# EAGLE design apollo3 MCU (EAGLE 9.6.2)

## Sheet 1 of 2
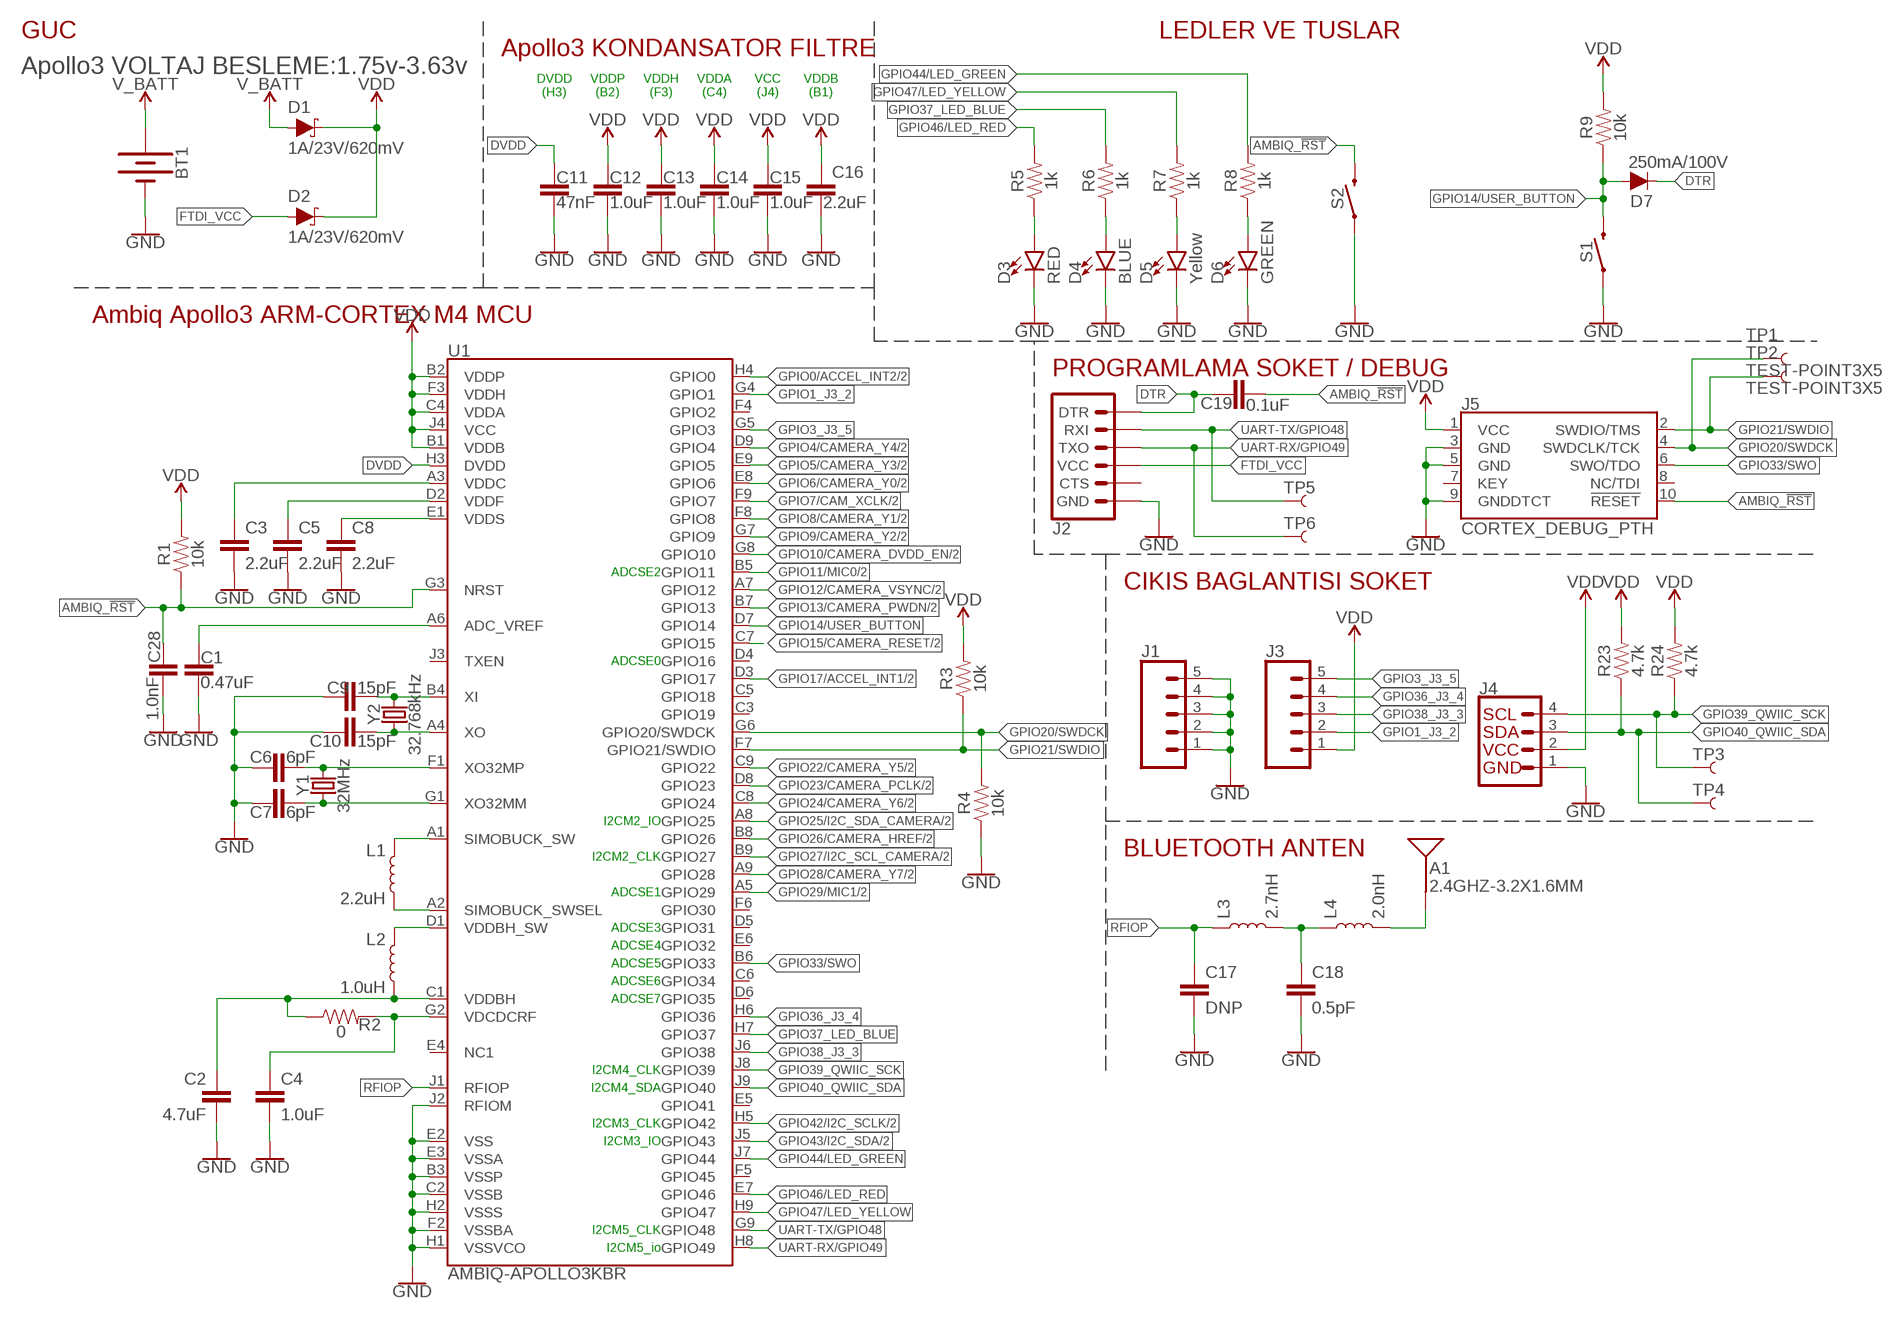
[diagram p0: schematic, sheet 1]

### Parts
A1  2.4GHZ-3.2X1.6MM  ANTENNA-2.4GHZ-3.2X1.6MM  [ANT-2.4GHZ-3.2X1.6X1.2MM]
BT1  BATTERY-20MM_SMD_4LEGS_OVERPASTE_INNER  [BATTCON_20MM_4LEGS_OVERPASTE_INNER]
C1  0.47uF  0.47UF-0402-TIGHT-6.3V-10%  [0402-TIGHT]
C2  4.7uF  4.7UF-0402-TIGHT-6.3V-(20%)  [0402-TIGHT]
C3  2.2uF  2.2UF-0402-TIGHT-25V-10%  [0402-TIGHT]
C4  1.0uF  1.0UF-0402-TIGHT-16V-10%  [0402-TIGHT]
C5  2.2uF  2.2UF-0402-TIGHT-25V-10%  [0402-TIGHT]
C6  6pF  6PF-0402-TIGHT-50V-0.5%  [0402-TIGHT]
C7  6pF  6PF-0402-TIGHT-50V-0.5%  [0402-TIGHT]
C8  2.2uF  2.2UF-0402-TIGHT-25V-10%  [0402-TIGHT]
C9  15pF  15PF-0402-TIGHT-50V-5%  [0402-TIGHT]
C10  15pF  15PF-0402-TIGHT-50V-5%  [0402-TIGHT]
C11  47nF  47NF-0402-TIGHT-25V-10%  [0402-TIGHT]
C12  1.0uF  1.0UF-0402-TIGHT-16V-10%  [0402-TIGHT]
C13  1.0uF  1.0UF-0402-TIGHT-16V-10%  [0402-TIGHT]
C14  1.0uF  1.0UF-0402-TIGHT-16V-10%  [0402-TIGHT]
C15  1.0uF  1.0UF-0402-TIGHT-16V-10%  [0402-TIGHT]
C16  2.2uF  2.2UF-0402-TIGHT-25V-10%  [0402-TIGHT]
C17  DNP  DNP-CAP-0402-TIGHT  [0402-TIGHT]
C18  0.5pF  0.5PF-0402-0.5PF-1%  [0402-TIGHT]
C19  0.1uF  0.1UF-0402-TIGHT-16V-10%  [0402-TIGHT]
C28  1.0nF  1.0NF/1000PF-0402-50V-10%  [0402-TIGHT]
D1  1A/23V/620mV  DIODE-SCHOTTKY-BAT20J  [SOD-323@1]
D2  1A/23V/620mV  DIODE-SCHOTTKY-BAT20J  [SOD-323@1]
D3  RED  LED-RED0603  [LED-0603]
D4  BLUE  LED-BLUE0603  [LED-0603]
D5  Yellow  LED-YELLOW0603  [LED-0603]
D6  GREEN  LED-GREEN0603  [LED-0603]
D7  250mA/100V  DIODE-BAS16J  [SOD-323]
J1  CONN_05NO_SILK  [1X05_NO_SILK]
J2  6_PIN_SERIAL_TARGETSMD  [1X06-SMD_RA_MALE]
J3  CONN_05NO_SILK  [1X05_NO_SILK]
J4  QWIIC_CONNECTORJS-1MM  [1X04_1MM_RA]
J5  CORTEX_DEBUG_PTH  [2X5-PTH-1.27MM]
L1  2.2uH  INDUCTOR-0805-2.2UH  [0805-WIDE]
L2  1.0uH  INDUCTOR-0805-1.0UH  [0805-WIDE]
L3  2.7nH  INDUCTOR-0402-2.7NH  [0402-TIGHT]
L4  2.0nH  INDUCTOR-0402-2.0NH  [0402-TIGHT]
R1  10k  10KOHM-0402-TIGHT-1/10W-1%  [0402-TIGHT]
R2  0  0OHM-0402-TIGHT-1/10W-5%  [0402-TIGHT]
R3  10k  10KOHM-0402-TIGHT-1/10W-1%  [0402-TIGHT]
R4  10k  10KOHM-0402-TIGHT-1/10W-1%  [0402-TIGHT]
R5  1k  1KOHM-0603-1/10W-1%  [0603]
R6  1k  1KOHM-0603-1/10W-1%  [0603]
R7  1k  1KOHM-0603-1/10W-1%  [0603]
R8  1k  1KOHM-0603-1/10W-1%  [0603]
R9  10k  10KOHM-0402-TIGHT-1/10W-1%  [0402-TIGHT]
R23  4.7k  4.7KOHM-0603-1/10W-1%  [0603]
R24  4.7k  4.7KOHM-0603-1/10W-1%  [0603]
S1  MOMENTARY-SWITCH-SPST-SMD-5.2-TALL-REDUNDANT  [TACTILE_SWITCH_SMD_5.2MM]
S2  MOMENTARY-SWITCH-SPST-SMD-5.2-TALL-REDUNDANT  [TACTILE_SWITCH_SMD_5.2MM]
TP1  TEST-POINT3X5  [PAD.03X.05]
TP2  TEST-POINT3X5  [PAD.03X.05]
TP3  TEST-POINT3X5  [PAD.03X.05]
TP4  TEST-POINT3X5  [PAD.03X.05]
TP5  TEST-POINT3X5  [PAD.03X.05]
TP6  TEST-POINT3X5  [PAD.03X.05]
U1  AMBIQ-APOLLO3KBR  [BGA-81-5X5MM]
Y1  32MHz  CRYSTAL-32MHZ-SMD-2.0X1.6MM  [CRYSTAL-SMD-2.0X1.6MM]
Y2  32.768kHz  CRYSTAL-32.768KHZSMD-3.2X1.5  [CRYSTAL-SMD-3.2X1.5MM]

### Nets
ADC_VREF: C1.1 U1.A6(ADC_VREF)
AMBIQ_!RST: C19.2 C28.1 J5.10(!RESET) R1.1 S2.3 S2.4 U1.G3(NRST)
DTR: C19.1 D7.C J2.1(DTR)
DVDD: C11.1 U1.H3(DVDD)
FTDI_VCC: D2.A J2.4(VCC)
GND: BT1.2(-) C1.2 C2.2 C3.2 C4.2 C5.2 C6.1 C7.1 C8.2 C9.1 C10.1 C11.2 C12.2 C13.2 C14.2 C15.2 C16.2 C17.2 C18.2 C28.2 D3.C D4.C D5.C D6.C J1.1 J1.2 J1.3 J1.4 J1.5 J2.6(GND) J4.1 J5.3(GND) J5.5(GND) J5.9(GNDDTCT) R4.1 S1.1 S1.2 S2.1 S2.2 U1.B3(VSSP) U1.C2(VSSB) U1.E2(VSS) U1.E3(VSSA) U1.F2(VSSBA) U1.H1(VSSVCO) U1.H2(VSSS) U1.J2(RFIOM) ; also sheet 2
GPIO0/ACCEL_INT2: U1.H4(GPIO0) ; also sheet 2
GPIO1_J3_2: J3.2 U1.G4(GPIO1)
GPIO3_J3_5: J3.5 U1.G5(GPIO3)
GPIO4/CAMERA_Y4: U1.D9(GPIO4) ; also sheet 2
GPIO5/CAMERA_Y3: U1.E9(GPIO5) ; also sheet 2
GPIO6/CAMERA_Y0: U1.E8(GPIO6) ; also sheet 2
GPIO7/CAM_XCLK: U1.F9(GPIO7) ; also sheet 2
GPIO8/CAMERA_Y1: U1.F8(GPIO8) ; also sheet 2
GPIO9/CAMERA_Y2: U1.G7(GPIO9) ; also sheet 2
GPIO10/CAMERA_DVDD_EN: U1.G8(GPIO10) ; also sheet 2
GPIO11/MIC0: U1.B5(GPIO11) ; also sheet 2
GPIO12/CAMERA_VSYNC: U1.A7(GPIO12) ; also sheet 2
GPIO13/CAMERA_PWDN: U1.B7(GPIO13) ; also sheet 2
GPIO14/USER_BUTTON: D7.A R9.1 S1.3 S1.4 U1.D7(GPIO14)
GPIO15/CAMERA_RESET: U1.C7(GPIO15) ; also sheet 2
GPIO17/ACCEL_INT1: U1.D3(GPIO17) ; also sheet 2
GPIO20/SWDCK: J5.4(SWDCLK/TCK) R4.2 TP1.P$1 U1.G6(GPIO20/SWDCK)
GPIO21/SWDIO: J5.2(SWDIO/TMS) R3.1 TP2.P$1 U1.F7(GPIO21/SWDIO)
GPIO22/CAMERA_Y5: U1.C9(GPIO22) ; also sheet 2
GPIO23/CAMERA_PCLK: U1.D8(GPIO23) ; also sheet 2
GPIO24/CAMERA_Y6: U1.C8(GPIO24) ; also sheet 2
GPIO25/I2C_SDA_CAMERA: U1.A8(GPIO25) ; also sheet 2
GPIO26/CAMERA_HREF: U1.B8(GPIO26) ; also sheet 2
GPIO27/I2C_SCL_CAMERA: U1.B9(GPIO27) ; also sheet 2
GPIO28/CAMERA_Y7: U1.A9(GPIO28) ; also sheet 2
GPIO29/MIC1: U1.A5(GPIO29) ; also sheet 2
GPIO33/SWO: J5.6(SWO/TDO) U1.B6(GPIO33)
GPIO36_J3_4: J3.4 U1.H6(GPIO36)
GPIO37_LED_BLUE: R6.2 U1.H7(GPIO37)
GPIO38_J3_3: J3.3 U1.J6(GPIO38)
GPIO39_QWIIC_SCK: J4.4 R24.1 TP3.P$1 U1.J8(GPIO39)
GPIO40_QWIIC_SDA: J4.3 R23.1 TP4.P$1 U1.J9(GPIO40)
GPIO42/I2C_SCLK: U1.H5(GPIO42) ; also sheet 2
GPIO43/I2C_SDA: U1.J5(GPIO43) ; also sheet 2
GPIO44/LED_GREEN: R8.2 U1.J7(GPIO44)
GPIO46/LED_RED: R5.2 U1.E7(GPIO46)
GPIO47/LED_YELLOW: R7.2 U1.H9(GPIO47)
N$1: A1.FEED(SIGNAL) L4.2
N$2: C7.2 U1.G1(XO32MM) Y1.1
N$3: C6.2 U1.F1(XO32MP) Y1.3
N$5: D4.A R6.1
N$6: D3.A R5.1
N$7: D5.A R7.1
N$8: D6.A R8.1
N$16: C18.1 L3.2 L4.1
RFIOP: C17.1 L3.1 U1.J1(RFIOP)
SIMBUCK_SWSEL: L1.2 U1.A2(SIMOBUCK_SWSEL)
SIMOBUCK_SW: L1.1 U1.A1(SIMOBUCK_SW)
UART-RX/GPIO49: J2.3(TXO) TP6.P$1 U1.H8(GPIO49)
UART-TX/GPIO48: J2.2(RXI) TP5.P$1 U1.G9(GPIO48)
V_BATT: BT1.1(+) D1.A
VDCDCRF: C4.1 R2.2 U1.G2(VDCDCRF)
VDD: C12.1 C13.1 C14.1 C15.1 C16.1 D1.C D2.C J3.1 J4.2 J5.1(VCC) R1.2 R3.2 R9.2 R23.2 R24.2 U1.B1(VDDB) U1.B2(VDDP) U1.C4(VDDA) U1.F3(VDDH) U1.J4(VCC) ; also sheet 2
VDDBH: C2.1 L2.2 R2.1 U1.C1(VDDBH)
VDDBH_SW: L2.1 U1.D1(VDDBH_SW)
VDDC: C3.1 U1.A3(VDDC)
VDDF: C5.1 U1.D2(VDDF)
VDDS: C8.1 U1.E1(VDDS)
X0: C10.2 U1.A4(XO) Y2.P$1
XI: C9.2 U1.B4(XI) Y2.P$2
Unconnected: J2.5(CTS) J5.7(KEY) J5.8(NC/TDI) U1.C3(GPIO19) U1.C5(GPIO18) U1.C6(GPIO34) U1.D4(GPIO16) U1.D5(GPIO31) U1.D6(GPIO35) U1.E4(NC1) U1.E5(GPIO41) U1.E6(GPIO32) U1.F4(GPIO2) U1.F5(GPIO45) U1.F6(GPIO30) U1.J3(TXEN)

### Notes on the sheet
- GUC | LEDLER VE TUSLAR
- Apollo3 KONDANSATOR FILTRE
- Apollo3 VOLTAJ BESLEME:1.75v-3.63v
- DVDD
  (H3)
- VDDP
  (B2)
- VDDH
  (F3)
- VDDA
  (C4)
- VCC
  (J4)
- VDDB
  (B1)
- Ambiq Apollo3 ARM-CORTEX M4 MCU
- PROGRAMLAMA SOKET / DEBUG
- ADCSE2 | CIKIS BAGLANTISI SOKET
- ADCSE0
- I2CM2_IO
- BLUETOOTH ANTEN
- I2CM2_CLK
- ADCSE1
- ADCSE3
- ADCSE4
- ADCSE5
- ADCSE6
- ADCSE7
- I2CM4_CLK
- I2CM4_SDA
- I2CM3_CLK
- I2CM3_IO
- I2CM5_CLK
- I2CM5_io

## Sheet 2 of 2
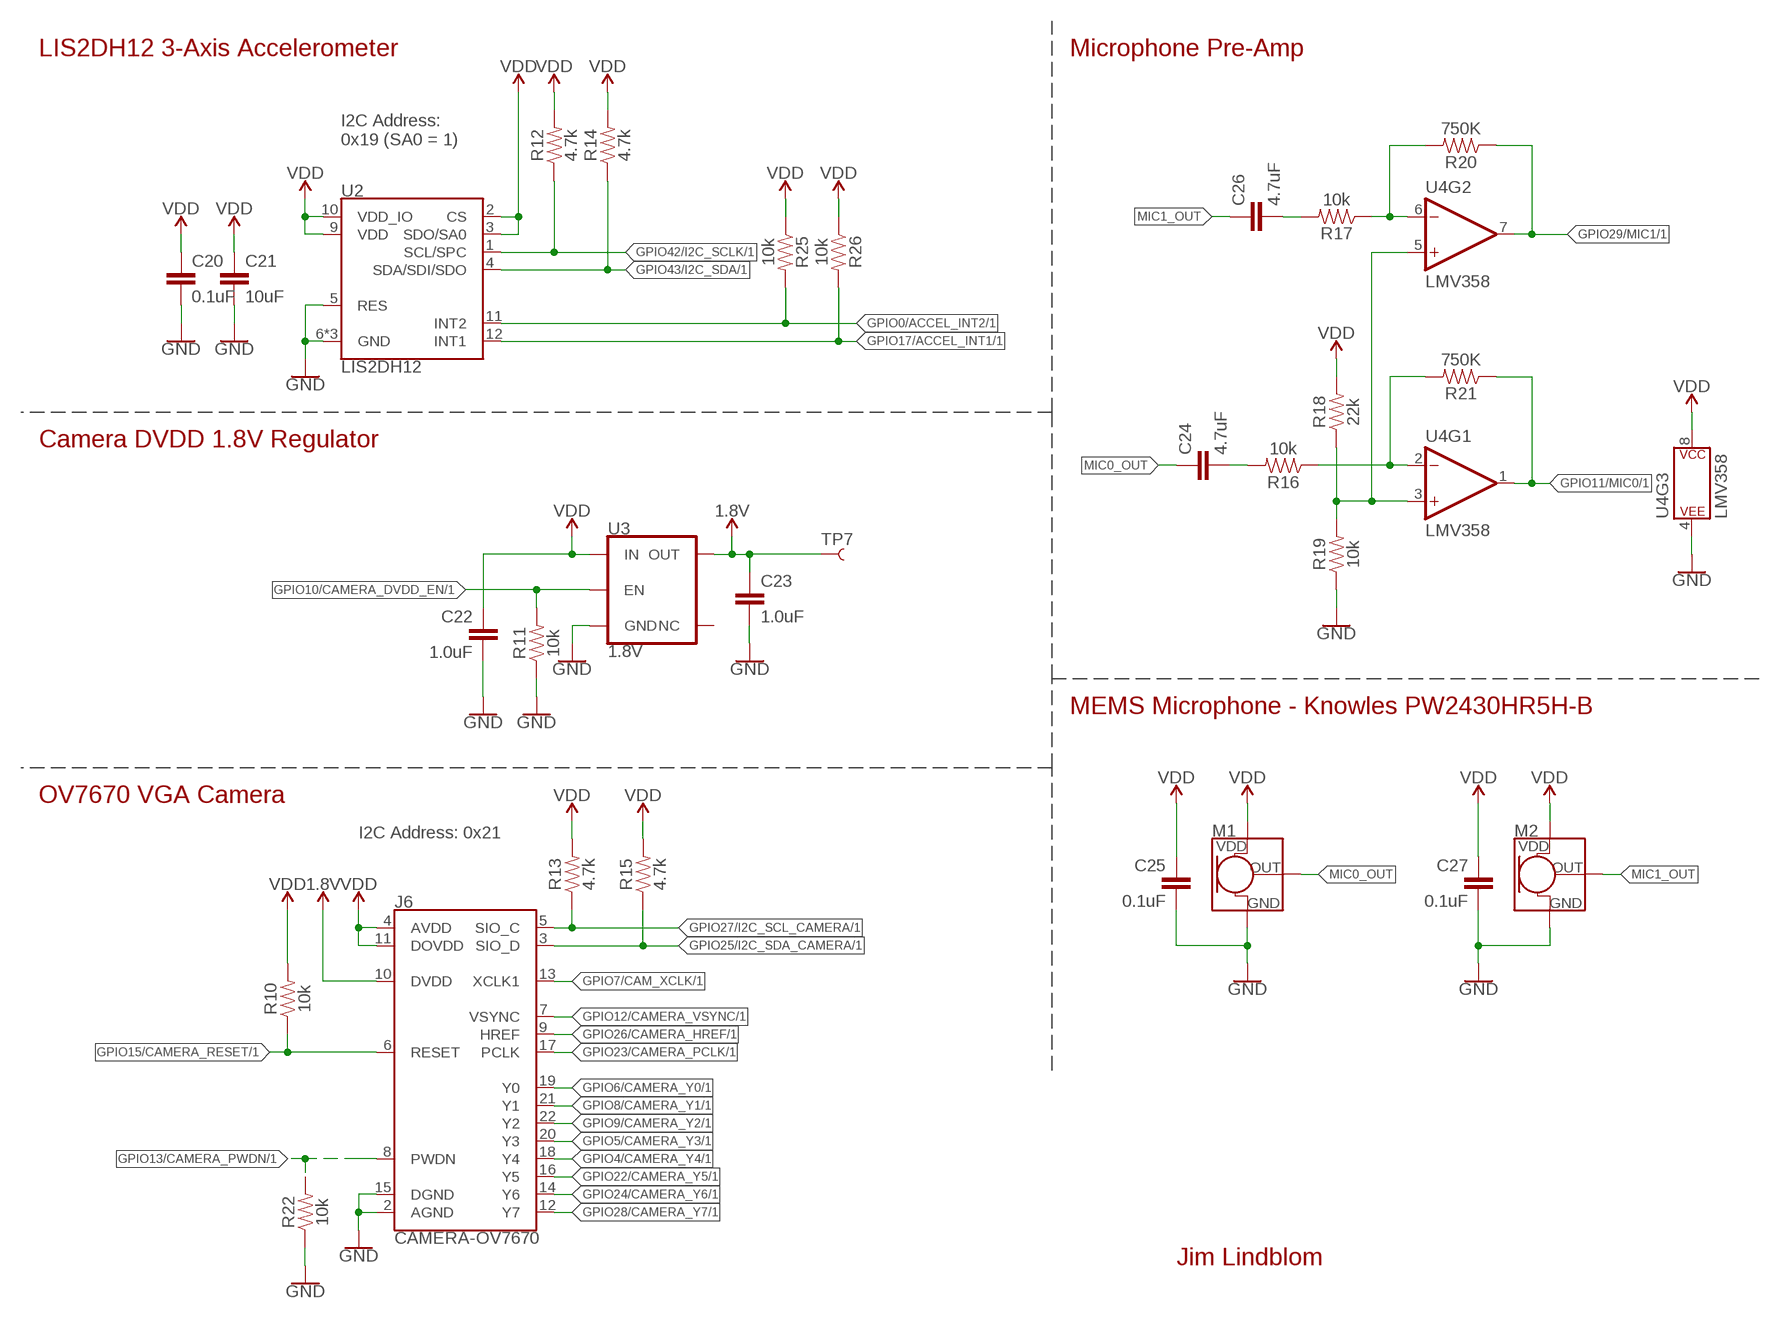
[diagram p1: schematic, sheet 2]

### Parts
C20  0.1uF  0.1UF-0402-TIGHT-16V-10%  [0402-TIGHT]
C21  10uF  10UF-0603-6.3V-20%  [0603]
C22  1.0uF  1.0UF-0402-TIGHT-16V-10%  [0402-TIGHT]
C23  1.0uF  1.0UF-0402-TIGHT-16V-10%  [0402-TIGHT]
C24  4.7uF  4.7UF-0603-6.3V-(10%)  [0603]
C25  0.1uF  0.1UF-0402-TIGHT-16V-10%  [0402-TIGHT]
C26  4.7uF  4.7UF-0603-6.3V-(10%)  [0603]
C27  0.1uF  0.1UF-0402-TIGHT-16V-10%  [0402-TIGHT]
J6  CAMERA-OV7670  [FPC-24-AMPHENOL-SFV24R-1STE1HLF]
M1  MEMS_MIC  MEMS_MICROPHONESPW2430HR5H-B  [SPW2430HR5H-B]
M2  MEMS_MIC  MEMS_MICROPHONESPW2430HR5H-B  [SPW2430HR5H-B]
R10  10k  10KOHM-0402-TIGHT-1/10W-1%  [0402-TIGHT]
R11  10k  10KOHM-0402-TIGHT-1/10W-1%  [0402-TIGHT]
R12  4.7k  4.7KOHM-0603-1/10W-1%  [0603]
R13  4.7k  4.7KOHM-0603-1/10W-1%  [0603]
R14  4.7k  4.7KOHM-0603-1/10W-1%  [0603]
R15  4.7k  4.7KOHM-0603-1/10W-1%  [0603]
R16  10k  10KOHM-0603-1/10W-1%  [0603]
R17  10k  10KOHM-0603-1/10W-1%  [0603]
R18  22k  22KOHM-0402-1/16W-1%  [0402-TIGHT]
R19  10k  10KOHM-0402-TIGHT-1/10W-1%  [0402-TIGHT]
R20  750K  750KOHM-0603-1/10W-1%  [0603]
R21  750K  750KOHM-0603-1/10W-1%  [0603]
R22  10k  10KOHM-0402-TIGHT-1/10W-1%  [0402-TIGHT]
R25  10k  10KOHM-0402-TIGHT-1/10W-1%  [0402-TIGHT]
R26  10k  10KOHM-0402-TIGHT-1/10W-1%  [0402-TIGHT]
TP7  TEST-POINT3X5  [PAD.03X.05]
U2  LIS2DH12  [LGA-12-LISDH12]
U3  1.8V  V_REG_AP2127K-2.8  [SOT23-5]
U4  LMV358  LMV358SOIC  [SO08]

### Nets
1.8V: C23.1 J6.10(DVDD) TP7.P$1 U3.5(OUT)
GND: C20.2 C21.2 C22.2 C23.2 C25.2 C27.2 J6.2(AGND) J6.15(DGND) M1.2(GND) M1.3(GND) M2.2(GND) M2.3(GND) R11.1 R19.1 R22.1 U2.5(RES) U2.6(GND) U2.7(GND) U2.8(GND) U3.2(GND) U4.4(P$V-) ; also sheet 1
GPIO0/ACCEL_INT2: R25.2 U2.11(INT2) ; also sheet 1
GPIO4/CAMERA_Y4: J6.18(Y4) ; also sheet 1
GPIO5/CAMERA_Y3: J6.20(Y3) ; also sheet 1
GPIO6/CAMERA_Y0: J6.19(Y0) ; also sheet 1
GPIO7/CAM_XCLK: J6.13(XCLK1) ; also sheet 1
GPIO8/CAMERA_Y1: J6.21(Y1) ; also sheet 1
GPIO9/CAMERA_Y2: J6.22(Y2) ; also sheet 1
GPIO10/CAMERA_DVDD_EN: R11.2 U3.3(EN) ; also sheet 1
GPIO11/MIC0: R21.1 U4.1(OUT) ; also sheet 1
GPIO12/CAMERA_VSYNC: J6.7(VSYNC) ; also sheet 1
GPIO13/CAMERA_PWDN: J6.8(PWDN) R22.2 ; also sheet 1
GPIO15/CAMERA_RESET: J6.6(RESET) R10.1 ; also sheet 1
GPIO17/ACCEL_INT1: R26.2 U2.12(INT1) ; also sheet 1
GPIO22/CAMERA_Y5: J6.16(Y5) ; also sheet 1
GPIO23/CAMERA_PCLK: J6.17(PCLK) ; also sheet 1
GPIO24/CAMERA_Y6: J6.14(Y6) ; also sheet 1
GPIO25/I2C_SDA_CAMERA: J6.3(SIO_D) R15.1 ; also sheet 1
GPIO26/CAMERA_HREF: J6.9(HREF) ; also sheet 1
GPIO27/I2C_SCL_CAMERA: J6.5(SIO_C) R13.1 ; also sheet 1
GPIO28/CAMERA_Y7: J6.12(Y7) ; also sheet 1
GPIO29/MIC1: R20.1 U4.7(OUT) ; also sheet 1
GPIO42/I2C_SCLK: R12.1 U2.1(SCL/SPC) ; also sheet 1
GPIO43/I2C_SDA: R14.1 U2.4(SDA/SDI/SDO) ; also sheet 1
MIC0_OUT: C24.1 M1.1(OUT)
MIC1_OUT: C26.1 M2.1(OUT)
N$9: R18.1 R19.2 U4.3(+IN) U4.5(+IN)
N$10: C24.2 R16.2
N$11: R17.1 R20.2 U4.6(-IN)
N$12: R16.1 R21.2 U4.2(-IN)
N$14: C26.2 R17.2
VDD: C20.1 C21.1 C22.1 C25.1 C27.1 J6.4(AVDD) J6.11(DOVDD) M1.4(VDD) M2.4(VDD) R10.2 R12.2 R13.2 R14.2 R15.2 R18.2 R25.1 R26.1 U2.2(CS) U2.3(SDO/SA0) U2.9(VDD) U2.10(VDD_IO) U3.1(IN) U4.8(P$V+) ; also sheet 1
Unconnected: J6.MNT1@0(MNT1) J6.MNT1@1(MNT1) J6.MNT2@0(MNT2) J6.MNT2@1(MNT2) U3.4(NC)

### Notes on the sheet
- LIS2DH12 3-Axis Accelerometer | Microphone Pre-Amp
- I2C Address:
  0x19 (SA0 = 1)
- Camera DVDD 1.8V Regulator
- MEMS Microphone - Knowles PW2430HR5H-B
- OV7670 VGA Camera
- I2C Address: 0x21
- Jim Lindblom

## Library data of the parts
A1 = ambiq:ANTENNA: Single-ended Antennae 2.4GHz and antennae with just one terminal. These are all chip antennae. 2.4GHz (WiFi/BT/ZigBee) Antennae ANT-2.4GHZ-6.5X2.2MM - 6.5 x 2.2 mm chip antenna. (SparkFun Product <https://www.sparkfun.com/products/144>) ANT-2.4GHZ8.0X1.0MM - 8.0 x 1.0 mm chip antenna. (Datasheet <http://www.mouser.com/ds/2/611/antenna_2500at44m0400-242425.pdf>) ANT-2.4GHZ9.5X2.0MM - 9.5 x 2.0 mm chip antenna. (SparkFun Product <https://www.sparkfun.com/products/9025>); DIGIKEY: 535-14095-2-ND; PROD_ID: ANT-14235
BT1 = SparkFun-Batteries:BATTERY: Battery - Single Cell A variety of battery chemistries, sizes, and footprints. Device List: 20MM_PTH - Coin Cell Battery Holder - 20mm (PTH) <https://www.sparkfun.com/products/783> 20MM_PTH_KIT- Coin Cell battery Holder - 20 mm (PTH) <http://www.sparkfun.com/products/783>kit version with special mask 6.8MM_PTH - Coin Cell Battery Holder - 6.8MM(SMD) <https://www.digikey.com/product-detail/en/seiko-instruments/MS621FE-FL11E/728-1057-ND/1889208?WT.srch=1&gclid=CNOQ5a6LzdQCFZS2wAodXCkE0g> 12MM_SMD - Coin Cell Battery Holder - 12mm (SMD) <https://www.sparkfun.com/products/10592> 12MM_PTH - Coin Cell Battery Holder - 12mm (PTH) <https://www.sparkfun.com/products/7948> 20MM_SMD - 20mm Coin Cell Battery Holder (SMD) (2 legs) Used on the Big Time Watch Kit <https://www.sparkfun.com/products/11734> 20MM_SMD_4LEGS - Coin Cell Battery Holder - 20mm (SMD) <https://www.sparkfun.com/products/11892> 20MM_SMD_4LEGS_OVERPASTE - Coin Cell Battery Holder - 20mm (SMD) <https://www.sparkfun.com/products/11892> (Over-paste on the legs) 24.5MM_PTH - Coin Cell Battery Holder - 24.5mm (PTH) <https://www.sparkfun.com/products/8863> 9V - 9V Battery Holder - PC Mount Used on the SparkFun SparkPunk Sound Kit <https://www.sparkfun.com/products/11177> and SparkFun SparkPunk Sequencer Kit <https://www.sparkfun.com/products/12707> 18650 - Battery Holder - 18650 (PTH) <https://www.sparkfun.com/products/13113> AA - Battery Holder - 1xAA (PTH) <https://www.sparkfun.com/products/7949> AAA - Battery Holder - 1xAAA (PTH) <https://www.sparkfun.com/products/12718> AA_KIT - Battery Holder - 1xAA (PTH) <https://www.sparkfun.com/products/7949> Special kit package - pads only have exposed copper on one side of the board. AAA_KIT - Battery Holder - 1xAAA (PTH) <https://www.sparkfun.com/products/12718> Special kit package - pads only have exposed copper on one side of the board.
C1 = ambiq:0.47UF: 0.47uF ceramic capacitor A capacitor is a passive two-terminal electrical component used to store electrical energy temporarily in an electric field.; DIGIKEY: 1276-1479-2-ND
C2 = ambiq:4.7UF: 4.7µF ceramic capacitors A capacitor is a passive two-terminal electrical component used to store electrical energy temporarily in an electric field.; DIGIKEY: 1276-1056-1-ND
C3 C5 C8 C16 = ambiq:2.2UF: 2.2µF ceramic capacitors A capacitor is a passive two-terminal electrical component used to store electrical energy temporarily in an electric field.; DIGIKEY: 1276-1462-2-ND
C4 C12-C15 C22 C23 = ambiq:1.0UF: 1µF ceramic capacitors A capacitor is a passive two-terminal electrical component used to store electrical energy temporarily in an electric field.; PROD_ID: CAP-12417
C6 C7 = ambiq:6PF: 6pF ceramic capacitors A capacitor is a passive two-terminal electrical component used to store electrical energy temporarily in an electric field.; PROD_ID: CAP-13455
C9 C10 = ambiq:15PF: 15pF ceramic capacitors A capacitor is a passive two-terminal electrical component used to store electrical energy temporarily in an electric field.; PROD_ID: CAP-13063
C11 = ambiq:47NF: 47nF ceramic capacitors A capacitor is a passive two-terminal electrical component used to store electrical energy temporarily in an electric field.; DIGIKEY: 311-1717-2-ND
C17 = ambiq:DNP-CAP: 0.18µF ceramic capacitor A capacitor is a passive two-terminal electrical component used to store electrical energy temporarily in an electric field.
C18 = ambiq:0.5PF: 0.5pF ceramic capacitor A capacitor is a passive two-terminal electrical component used to store electrical energy temporarily in an electric field.; DIGIKEY: 399-16299-1-ND
C19 C20 C25 C27 = ambiq:0.1UF: 0.1µF ceramic capacitors A capacitor is a passive two-terminal electrical component used to store electrical energy temporarily in an electric field.; PROD_ID: CAP-12416
C21 = SparkFun-Capacitors:10UF: 10.0µF ceramic capacitors A capacitor is a passive two-terminal electrical component used to store electrical energy temporarily in an electric field.; PROD_ID: CAP-11015
C24 C26 = SparkFun-Capacitors:4.7UF: 4.7µF ceramic capacitors A capacitor is a passive two-terminal electrical component used to store electrical energy temporarily in an electric field.; PROD_ID: CAP-08280
C28 = ambiq:1.0NF/1000PF: 1nF/1,000pF ceramic capacitors A capacitor is a passive two-terminal electrical component used to store electrical energy temporarily in an electric field.; DIGIKEY: 311-1036-2-ND
D1 D2 = SparkFun-DiscreteSemi:DIODE-SCHOTTKY: Schottky diode A Schottky diode is a semiconductor diode which has a low forward voltage drop and a very fast switching action.; PROD_ID: DIO-11623
D3 = SparkFun-LED:LED-RED: Red SMD LED Used in manufacturing of most products at SparkFun Packages: 0603 - SMD 0603 package [Product Link] <http://docs.avagotech.com/docs/AV02-0551EN> 0603 SMART - SMD 0603 SMART package ( more efficient and expensive)[Product Link] <http://www.osram-os.com/Graphics/XPic2/00077099_0.pdf> 1206 - SMD1206 package [Product Link] <https://www.sparkfun.com/datasheets/DevTools/LilyPad/Q150OVS4.pdff> SparkFun Products: Pro Mini 328 -5V <https://www.sparkfun.com/products/821> RedBoard <https://www.sparkfun.com/products/12757> IOIO-OTG <https://www.sparkfun.com/products/13613>; PROD_ID: DIO-00819
D4 = SparkFun-LED:LED-BLUE: Blue SMD LED Used in manufacturing of various products at SparkFun Packages: 0603 - SMD 0603 package [Product Link] <http://www.digikey.com/product-detail/en/SMLE12BC7TT86/511-1589-2-ND/1641808> 1206 - SMD1206 package [Product Link] <http://www.digikey.com/product-detail/en/lite-on-inc/LTST-C150TBKT/160-1643-1-ND/573584> SparkFun Products: ESP8266 Thing-Dev Board <https://www.sparkfun.com/products/13711> RedBoard <https://www.sparkfun.com/products/12757>; PROD_ID: DIO-08575
D5 = SparkFun-LED:LED-YELLOW: Yellow SMD LED Used in manufacturing several products at SparkFun. Packages: 0603 - SMD 0603 package[Product Link] <http://www.kingbrightusa.com/product.asp?catalog_name=LED&product_id=APT1608SYCK> 0603 -SMART - SMART SMD 0603 package (more efficient/more expensive) [Product Link] <http://www.osram-os.com/osram_os/en/products/product-catalog/led-light-emitting-diodes/smartled-0603/ly-l29k/index.jsp> LilyPad - SMD1206 package[Product Datasheet] <https://www.sparkfun.com/datasheets/DevTools/LilyPad/Q150YUS4.pdf> SparkFun Products: Blynk Board <https://www.sparkfun.com/products/13794> IOIO-OTG <https://www.sparkfun.com/products/13613> XBee Explorer Serial <https://www.sparkfun.com/products/13225>; PROD_ID: DIO-09003
D6 = SparkFun-LED:LED-GREEN: Green SMD LED Used in manufacturing of various products at SparkFun Packages: 0603 - SMD 0603 package [Product Link] <http://www.futureelectronics.com/en/technologies/semiconductors/optoelectronics/leds/Pages/9894312-LTST-C190GKT.aspx?CrossPart=HSMG-C190&IM=0> LilyPad 1206 - SMD1206 LilyPad package [Product Link] <http://www.futureelectronics.com/en/Technologies/Product.aspx?ProductID=IN150NGHARVATEKCORPORATION2049943&IM=0> 1206 - SMD1206 package [Product Link] <http://www.futureelectronics.com/en/technologies/semiconductors/optoelectronics/leds/Pages/8315665-LTST-C150KGKT.aspx?IM=0> 1206 Bottom Mount -SMD 1206 Bottom Mount [Product Link] <http://www.digikey.com/product-detail/en/lite-on-inc/LTST-C230KGKT/160-1456-1-ND/386854> SparkFun Products: Pro Mini 328 -5V <https://www.sparkfun.com/products/821> RedBoard <https://www.sparkfun.com/products/12757> MP3 Trigger <https://www.sparkfun.com/products/13720> Makey Makey <https://www.sparkfun.com/products/11076>; PROD_ID: DIO-00821
D7 = SparkFun-DiscreteSemi:DIODE: Diode These are standard reverse protection diodes and small signal diodes. SparkFun Products: SparkFun SparkPunk Sound Kit <https://www.sparkfun.com/products/11177> SparkFun ESP8266 Thing <https://www.sparkfun.com/products/13231>; PROD_ID: DIO-09646
J1 J3 = SparkFun-Connectors:CONN_05: Multi connection point. Often used as Generic Header-pin footprint for 0.1 inch spaced/style header connections On any of the 0.1 inch spaced packages, you can populate with these: Break Away Headers - Straight <https://www.sparkfun.com/products/116> (PRT-00116) Break Away Male Headers - Right Angle <https://www.sparkfun.com/products/553> (PRT-00553) Female Headers <https://www.sparkfun.com/products/115> (PRT-00115) Break Away Headers - Machine Pin <https://www.sparkfun.com/products/117> (PRT-00117) Break Away Female Headers - Swiss Machine Pin <https://www.sparkfun.com/products/743> (PRT-00743) For SCREWTERMINALS and SPRING TERMINALS visit here: Screw Terimnals on SparkFun.com <https://www.sparkfun.com/search/results?term=Screw+Terminals> (5mm/3.5mm/2.54mm spacing) This device is also useful as a general connection point to wire up your design to another part of your project. Our various solder wires solder well into these plated through hole pads. Hook-Up Wire - Assortment (Stranded, 22 AWG) <https://www.sparkfun.com/products/11375> (PRT-11375) Hook-Up Wire - Assortment (Solid Core, 22 AWG) <https://www.sparkfun.com/products/11367> (PRT-11367) View the entire wire category on our website here <https://www.sparkfun.com/categories/141> Special notes: Molex polarized connector foot print use with SKU : PRT-08231 with associated crimp pins and housings. 1MM SMD Version SKU: PRT-10208
J2 = SparkFun-Connectors:6_PIN_SERIAL_TARGET: 6-pin header connection for use with the "FTDI BASIC" pinout - TARGET SIDE. Also known as "Arduino Serial Program Header". It is used to mate with our FTDI Basic serial programmers using the Arduino IDE. Note, this device has "TARGET" in the name. It is intended to be used on a design that contains a target micro-controller that you wish to program. The "sister" device, named "CABLE" is inteneded to be used on a design that usually lives on the end of your USB cable and prvides the converter chip (FTDI232 or FTDI231x) to commnicate serial RX/TX. You can populate with some of these: Break Away Headers - Straight <https://www.sparkfun.com/products/116> (PRT-00116) For reference (or to suit your programming needs) check out these designs: SparkFun FTDI Basic Breakout - 5V <https://www.sparkfun.com/products/9716> (DEV-09716) SparkFun FTDI Basic Breakout - 3.3V <https://www.sparkfun.com/products/9873> (DEV-09873) SparkFun FTDI SmartBasic <https://www.sparkfun.com/products/12935> (DEV-12935) SparkFun Beefy 3 - FTDI Basic Breakout <https://www.sparkfun.com/products/13746> (DEV-13746); PROD_ID: CONN-08971
J4 = SparkFun-Connectors:QWIIC_CONNECTOR: SparkFun I2C Standard Qwiic Connector An SMD 1mm pitch JST connector makes it easy and quick (get it? Qwiic?) to connect I2C devices to each other. The Qwiic system <http://www.sparkfun.com/qwiic> enables fast and solderless connection between popular platforms and various sensors and actuators. We carry 200mm <https://www.sparkfun.com/products/14204>, 100mm <https://www.sparkfun.com/products/14205>, 50mm <https://www.sparkfun.com/products/14206>, and breadboard friendly <https://www.sparkfun.com/products/14207> Qwiic cables. We also offer 10 pcs strips <https://www.sparkfun.com/products/14323> the SMD connectors.; PROD_ID: CONN-13694
J5 = SparkFun-Connectors:CORTEX_DEBUG: Cortex Debug Connector - 10 pin Supports JTAG debug, Serial Wire debug, and Serial Wire Viewer. PTH and SMD connector options available. General Connector Information <http://infocenter.arm.com/help/topic/com.arm.doc.faqs/attached/13634/cortex_debug_connectors.pdf> Products: PTH Connector <http://www.digikey.com/product-detail/en/cnc-tech/3220-10-0100-00/1175-1627-ND/3883661> -via Digi-Key SparkFun PSoc <https://www.sparkfun.com/products/13229> SparkFun T <https://www.sparkfun.com/products/13810>
J6 = ambiq:CAMERA-OV7670; DIGIKEY: 609-4320-2-ND
L1 = ambiq:INDUCTOR: Inductors Resist changes in electrical current. Basically a coil of wire. SparkFun Products: SparkFun Load Cell Amplifier - HX711 <https://www.sparkfun.com/products/13879> IOIO-OTG - V2.2 <https://www.sparkfun.com/products/13613>; DIGIKEY: 490-17728-2-ND
L2 = ambiq:INDUCTOR: Inductors Resist changes in electrical current. Basically a coil of wire. SparkFun Products: SparkFun Load Cell Amplifier - HX711 <https://www.sparkfun.com/products/13879> IOIO-OTG - V2.2 <https://www.sparkfun.com/products/13613>; DIGIKEY: 587-2903-2-ND
L3 = ambiq:INDUCTOR: Inductors Resist changes in electrical current. Basically a coil of wire. SparkFun Products: SparkFun Load Cell Amplifier - HX711 <https://www.sparkfun.com/products/13879> IOIO-OTG - V2.2 <https://www.sparkfun.com/products/13613>; DIGIKEY: 445-172420-1-ND
L4 = ambiq:INDUCTOR: Inductors Resist changes in electrical current. Basically a coil of wire. SparkFun Products: SparkFun Load Cell Amplifier - HX711 <https://www.sparkfun.com/products/13879> IOIO-OTG - V2.2 <https://www.sparkfun.com/products/13613>; DIGIKEY: 490-6752-1-ND
M1 M2 = ambiq:MEMS_MICROPHONE; DIGIKEY: 423-1394-2-ND
R1 R3 R4 R9-R11 R19 R22 R25 R26 = ambiq:10KOHM: 10kΩ resistor A resistor is a passive two-terminal electrical component that implements electrical resistance as a circuit element. Resistors act to reduce current flow, and, at the same time, act to lower voltage levels within circuits. - Wikipedia; DIGIKEY: 311-10.0KLRTR-ND
R2 = ambiq:0OHM: 0Ω resistor A resistor is a passive two-terminal electrical component that implements electrical resistance as a circuit element. Resistors act to reduce current flow, and, at the same time, act to lower voltage levels within circuits. - Wikipedia; DIGIKEY: 311-0.0JRTR-ND
R5-R8 = SparkFun-Resistors:1KOHM: 1kΩ resistor A resistor is a passive two-terminal electrical component that implements electrical resistance as a circuit element. Resistors act to reduce current flow, and, at the same time, act to lower voltage levels within circuits. - Wikipedia; PROD_ID: RES-07856
R12-R15 R23 R24 = SparkFun-Resistors:4.7KOHM: 4.7kΩ resistor A resistor is a passive two-terminal electrical component that implements electrical resistance as a circuit element. Resistors act to reduce current flow, and, at the same time, act to lower voltage levels within circuits. - Wikipedia; PROD_ID: RES-07857
R16 R17 = SparkFun-Resistors:10KOHM: 10kΩ resistor A resistor is a passive two-terminal electrical component that implements electrical resistance as a circuit element. Resistors act to reduce current flow, and, at the same time, act to lower voltage levels within circuits. - Wikipedia; PROD_ID: RES-00824
R18 = ambiq:22KOHM: 22kΩ resistor A resistor is a passive two-terminal electrical component that implements electrical resistance as a circuit element. Resistors act to reduce current flow, and, at the same time, act to lower voltage levels within circuits. - Wikipedia; DIGIKEY: 311-22.0KLRTR-ND
R20 R21 = SparkFun-Resistors:750KOHM: 750Ω resistor A resistor is a passive two-terminal electrical component that implements electrical resistance as a circuit element. Resistors act to reduce current flow, and, at the same time, act to lower voltage levels within circuits. - Wikipedia; PROD_ID: RES-13768
S1 S2 = SparkFun-Switches:MOMENTARY-SWITCH-SPST: Momentary Switch (Pushbutton) - SPST Normally-open (NO) SPST momentary switches (buttons, pushbuttons). Variants PTH-12MM - 12mm square, through-hole Momentary Pushbutton Switch - 12mm Square <https://www.sparkfun.com/products/9190> (COM-09190) PTH-6.0MM, PTH-6.0MM-KIT - 6.0mm square, through-hole Mini Pushbutton Switch <https://www.sparkfun.com/products/97> (COM-00097) KIT package intended for soldering kit's - only one side of pads' copper is exposed. PTH-RIGHT-ANGLE-KIT - Right-angle, through-hole Right Angle Tactile Button <https://www.sparkfun.com/products/10791> - Used on SparkFun BigTime Watch Kit <https://www.sparkfun.com/products/11734> SMD-12MM - 12mm square, surface-mount Tactile Button - SMD (12mm) <https://www.sparkfun.com/products/12993> (COM-12993) Used on SparkFun PicoBoard <https://www.sparkfun.com/products/11888> SMD-4.5MM - 4.5mm Square Trackball Switch Used on SparkFun Blackberry Trackballer Breakout <https://www.sparkfun.com/products/13169> SMD-4.6MMX2.8MM - 4.60mm x 2.80mm, surface mount Used on SparkFun SAMD21 Mini Breakout <https://www.sparkfun.com/products/13664> SMD-5.2MM, SMD-5.2-REDUNDANT - 5.2mm square, surface-mount Mini Pushbutton Switch - SMD <https://www.sparkfun.com/products/8720> (COM-08720) Used on Arduino Pro Mini <https://www.sparkfun.com/products/11114> REDUNDANT package connects both switch circuits together SMD-6.0X3.5MM - 6.0 x 3.5mm, surface mount Momentary Reset Switch SMD <https://www.sparkfun.com/products/8229> (COM-08229) SMD-6.2MM-TALL - 6.2mm square, surface mount Tactile Button - SMD (6mm) <https://www.sparkfun.com/products/12992> Used on SparkFun Digital Sandbox <https://www.sparkfun.com/products/12651> SMD-RIGHT-ANGLE - Right-angle, surface mount Used on SparkFun Block for Intel® Edison - Arduino <https://www.sparkfun.com/products/13036>; PROD_ID: SWCH-14139
TP1-TP7 = SparkFun-Connectors:TEST-POINT: SparkFun Test Points Bare copper test points for troubleshooting or In-Circuit-Testing. These are used by our Production team for verifying production board runs using pogo-pins on test beds. SparkFun Products: SparkFun LSM9DS1 Breakout <https://www.sparkfun.com/products/13284> SparkFun PSOC <https://www.sparkfun.com/products/13714> SparkFun Load Cell Amplifier <https://www.sparkfun.com/products/13879>
U1 = ambiq:AMBIQ-APOLLO3
U2 = ambiq:LIS2DH12; DIGIKEY: 497-14851-2-ND
U3 = ambiq:V_REG_AP2127: Diodes Inc AP2127 -- 300mA LDO Regulator Datasheet <https://www.diodes.com/assets/Datasheets/AP2127.pdf>; DIGIKEY: AP2127K-1.8TRG1DITR-ND
U4 = SparkFun-IC-Amplifiers:LMV358: IC LMV358 DUAL OP AMP Jellybean rail-to-rail output op-amp SparkFun Products SparkFun PicoBoard <https://www.sparkfun.com/products/11888> (WIG-11888) SparkFun Vernier Interface Shield <https://www.sparkfun.com/products/12858> (DEV-12858) SparkFun Blynk Board - ESP8266 <https://www.sparkfun.com/products/13794> (WRL-13794) SparkFun Digital Sandbox <https://www.sparkfun.com/products/12651> (DEV-12651 RoHS); PROD_ID: IC-09657
Y1 = SparkFun-Clocks:CRYSTAL-32MHZ: 32MHz Crystal Digikey Example <http://www.digikey.com/product-detail/en/murata-electronics-north-america/XRCGB32M000F2P00R0/490-9769-1-ND/4952013> Frequency: 32MHz Frequency Stability: ±20ppm Frequency Tolerance: ±20ppm Load Capacitance: 6pF SparkFun Products SparkFun nRF52832 Breakout <https://www.sparkfun.com/products/13990>; PROD_ID: XTAL-13459
Y2 = SparkFun-Clocks:CRYSTAL-32.768KHZ: 32.768kHz Crystal Frequency: 32.768kHz Frequency Stability: ±20ppm Load Capacitance: 12.5pF (PTH-2X6 & SMD-3.2X1.5), 6pF (SMD-2X6) SparkFun Products: SparkFun BigTime Watch Kit <https://www.sparkfun.com/products/11734> SparkFun nRF52832 Breakout <https://www.sparkfun.com/products/13990> SparkFun Real Time Clock Module <https://www.sparkfun.com/products/12708>; PROD_ID: XTAL-13062

## Net classes
0 default: width 0 mm, drill 0 mm
2 usb: width 0.254 mm, drill 0.305 mm, clearance 0.254 mm

## Board
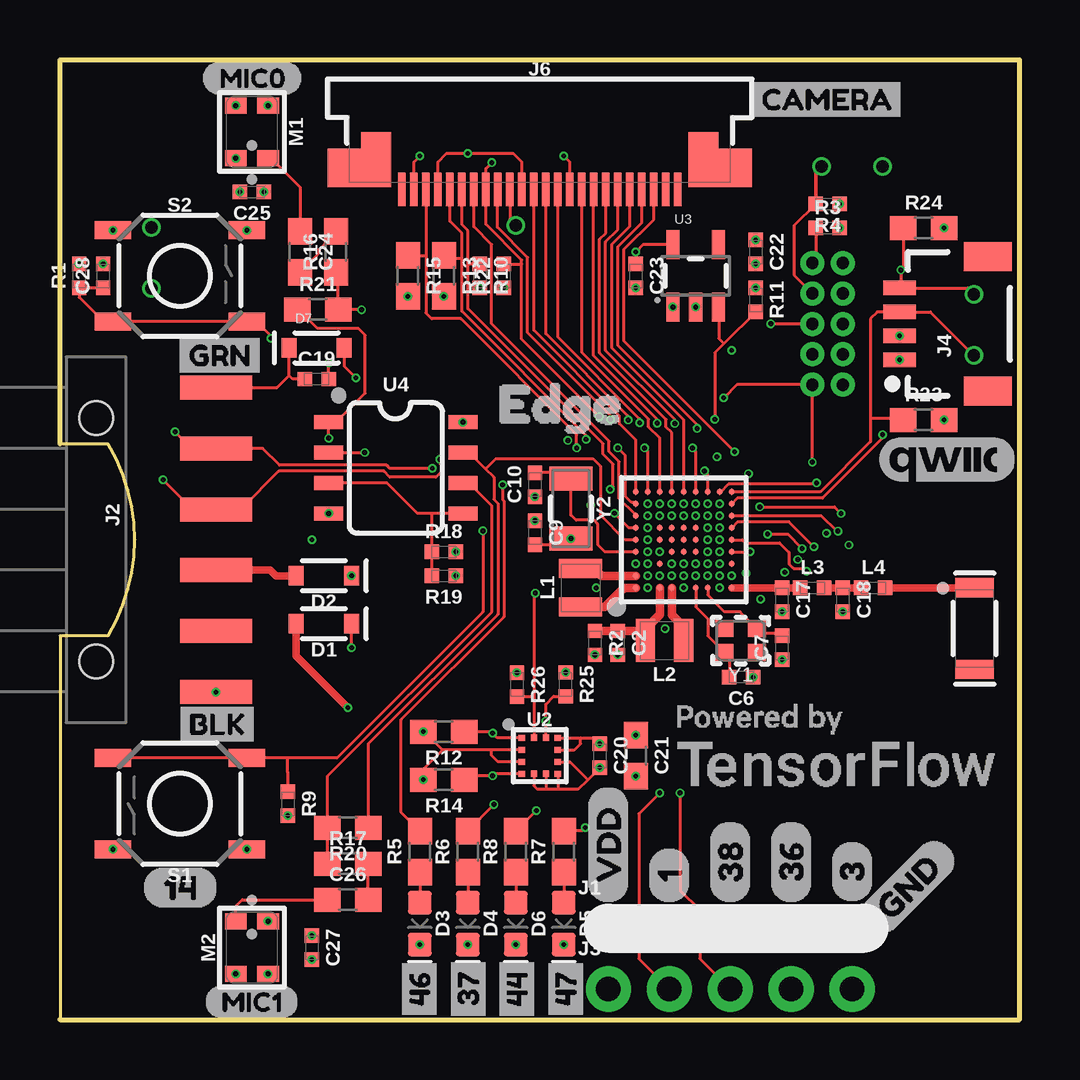
[diagram p2: board, top side]
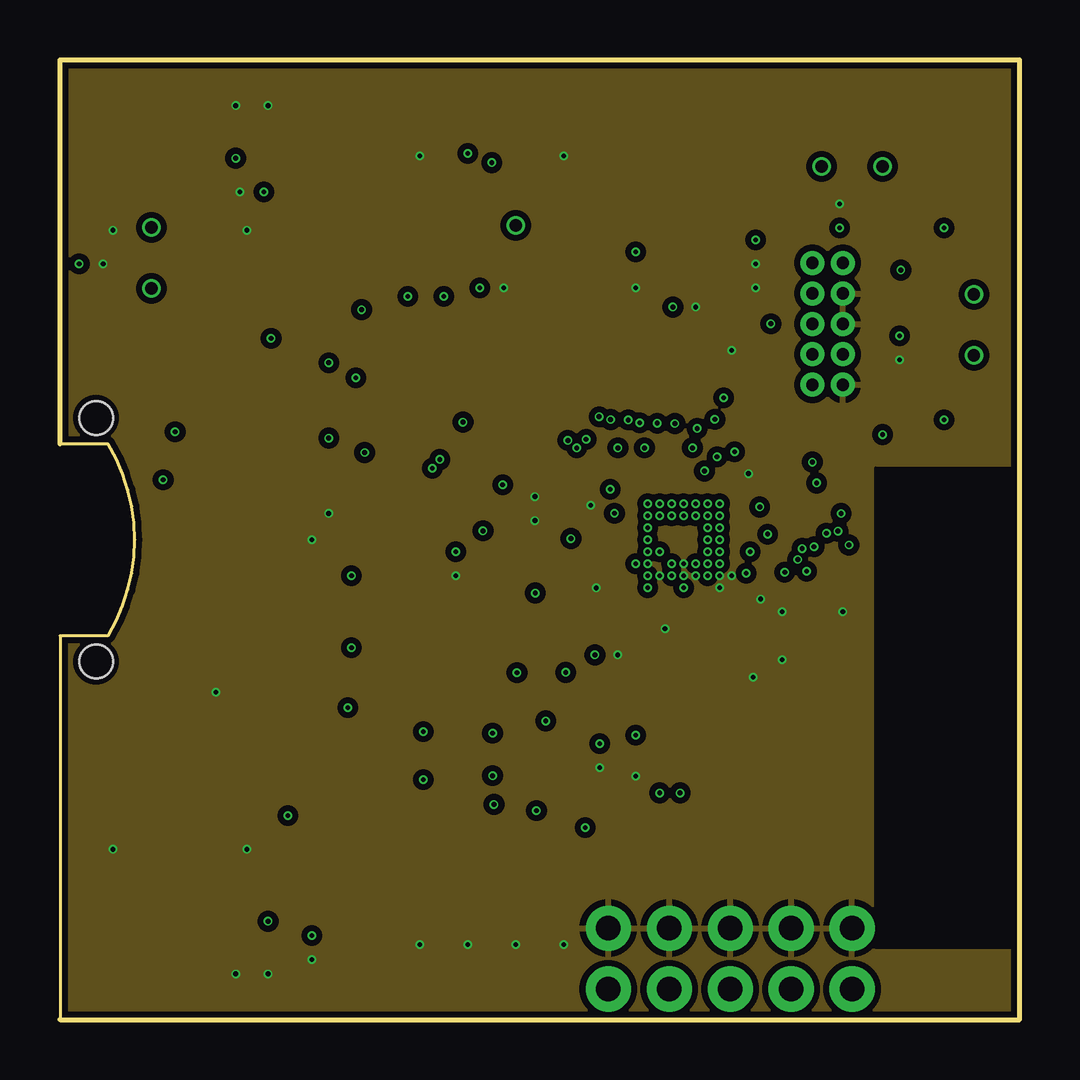
[diagram p3: board, inner layer Route2]
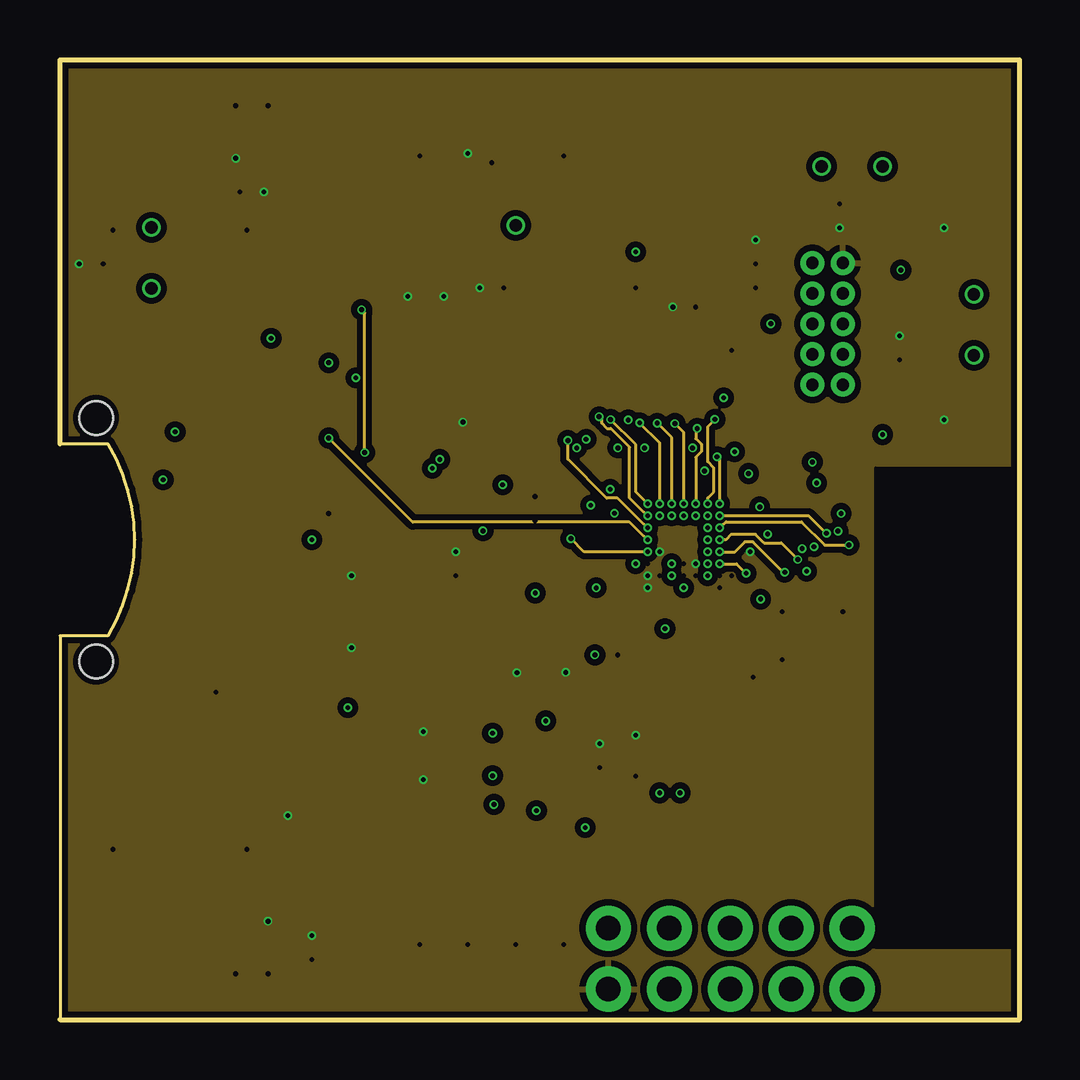
[diagram p4: board, inner layer Route15]
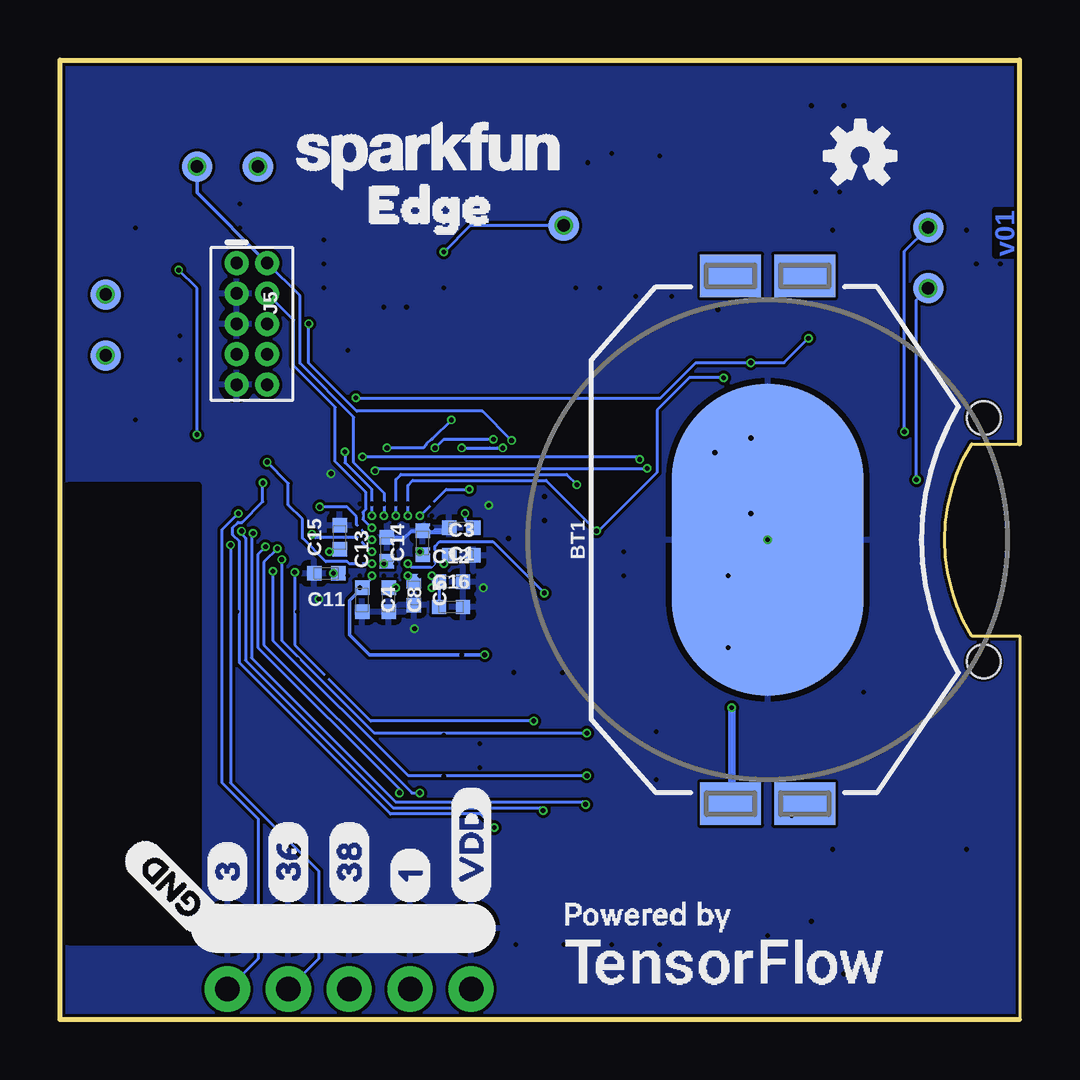
[diagram p5: board, bottom side, seen from below]

Size 40 x 40 mm. Coordinates in mm from the lower left corner, seen from the top.
Outline: 0,0 40,0 40,40 0,40 0,24 2,24 arc-62 2,16 0,16 0,0
Copper layers ([15:(1*2)+15*16]): Top 0.035mm / dielectric 0.213359375mm / Route2 0.035mm / dielectric 1.0161mm / Route15 0.035mm / dielectric 0.213359375mm / Bottom 0.035mm
Design rules "SparkFun-4-layer-PCBWAY-LIMIT": minimum track width 5mil, minimum drill 0.2mm, track to track 5mil, track to pad 5mil, pad to pad 5mil, via to via 5mil, smd to smd 0mil, copper to edge 5mil, drill to drill 5mil, minimum pad ring 3mil, minimum via ring 3mil, stop-mask expansion 4mil, vias tented up to drill 25mil, thermal gap 10mil

### Footprints (pad centres in the part's own frame; a part is rotated, then mirrored left to right if it is on the bottom)
ANT-2.4GHZ-3.2X1.6X1.2MM = smd 0.8 x 1.6: FEED -1.7,0; NC 1.7,0
BATTCON_20MM_4LEGS_OVERPASTE_INNER = smd 1.778 x 2.54: 1 -11,1.55; 3 11,1.55; P$1 -11,-1.55; P$2 11,-1.55 | smd 13 x 8: 2 0,0
0402-TIGHT = smd 0.6 x 0.6: 1 -0.5,0; 2 0.5,0
0603 = smd 1.1 x 1: 1 -0.85,0; 2 0.85,0
SOD-323@1 = smd 0.63 x 0.83: A 1.15,0; C -1.15,0
LED-0603 = smd 1 x 1: A -0.877,0; C 0.877,0
SOD-323 = smd 0.63 x 0.83: A 1.15,0; C -1.15,0
1X05_NO_SILK = drill 1.016 pad 1.88: 1 0,0; 2 2.54,0; 3 5.08,0; 4 7.62,0; 5 10.16,0
1X06-SMD_RA_MALE = smd 1 x 3: 1 -6.35,5; 2 -3.81,5; 3 -1.27,5; 4 1.27,5; 5 3.81,5; 6 6.35,5 | hole 1.4: -5.08,0; 5.08,0
1X04_1MM_RA = smd 0.6 x 1.35: 1 -1.5,0; 2 -0.5,0; 3 0.5,0; 4 1.5,0 | smd 1.2 x 2: NC1 2.8,-3.675; NC2 -2.8,-3.675
2X5-PTH-1.27MM = drill 0.508 pad 1: 1 -2.54,-0.635; 2 -2.54,0.635; 3 -1.27,-0.635; 4 -1.27,0.635; 5 0,-0.635; 6 0,0.635; 7 1.27,-0.635; 8 1.27,0.635; 9 2.54,-0.635; 10 2.54,0.635
FPC-24-AMPHENOL-SFV24R-1STE1HLF = smd 0.3 x 1.4: 1 5.75,2.4; 2 5.25,2.4; 3 4.75,2.4; 4 4.25,2.4; 5 3.75,2.4; 6 3.25,2.4; 7 2.75,2.4; 8 2.25,2.4; 9 1.75,2.4; 10 1.25,2.4; 11 0.75,2.4; 12 0.25,2.4; 13 -0.25,2.4; 14 -0.75,2.4; 15 -1.25,2.4; 16 -1.75,2.4; 17 -2.25,2.4; 18 -2.75,2.4; 19 -3.25,2.4; 20 -3.75,2.4; 21 -4.25,2.4; 22 -4.75,2.4; 23 -5.25,2.4; 24 -5.75,2.4 | smd 1.4 x 1.6: MNT1@0 -8.15,1.5; MNT2@1 8.15,1.5 | smd 1.25 x 2.3: MNT1@1 -6.825,1.15; MNT2@0 6.825,1.15
0805-WIDE = smd 0.8 x 1.8: 1 -0.8,0; 2 0.8,0
SPW2430HR5H-B = smd 0.9 x 0.66: 1 -0.675,1.095; 2 -0.675,-1.095; 3 0.675,-1.095; 4 0.675,1.095
TACTILE_SWITCH_SMD_5.2MM = smd 1.524 x 0.762: 1 -2.794,1.905; 2 2.794,1.905; 3 -2.794,-1.905; 4 2.794,-1.905
PAD.03X.05 = smd 1.27 x 1.27: P$1 0,0
BGA-81-5X5MM = smd 0.254 x 0.254: A1 -2,2; A2 -1.5,2; A3 -1,2; A4 -0.5,2; A5 0,2; A6 0.5,2; A7 1,2; A8 1.5,2; A9 2,2; B1 -2,1.5; B2 -1.5,1.5; B3 -1,1.5; B4 -0.5,1.5; B5 0,1.5; B6 0.5,1.5; B7 1,1.5; B8 1.5,1.5; B9 2,1.5; C1 -2,1; C2 -1.5,1; C3 -1,1; C4 -0.5,1; C5 0,1; C6 0.5,1; C7 1,1; C8 1.5,1; C9 2,1; D1 -2,0.5; D2 -1.5,0.5; D3 -1,0.5; D4 -0.5,0.5; D5 0,0.5; D6 0.5,0.5; D7 1,0.5; D8 1.5,0.5; D9 2,0.5; E1 -2,0; E2 -1.5,0; E3 -1,0; E4 -0.5,0; E5 0,0; E6 0.5,0; E7 1,0; E8 1.5,0; E9 2,0; F1 -2,-0.5; F2 -1.5,-0.5; F3 -1,-0.5; F4 -0.5,-0.5; F5 0,-0.5; F6 0.5,-0.5; F7 1,-0.5; F8 1.5,-0.5; F9 2,-0.5; G1 -2,-1; G2 -1.5,-1; G3 -1,-1; G4 -0.5,-1; G5 0,-1; G6 0.5,-1; G7 1,-1; G8 1.5,-1; G9 2,-1; H1 -2,-1.5; H2 -1.5,-1.5; H3 -1,-1.5; H4 -0.5,-1.5; H5 0,-1.5; H6 0.5,-1.5; H7 1,-1.5; H8 1.5,-1.5; H9 2,-1.5; J1 -2,-2; J2 -1.5,-2; J3 -1,-2; J4 -0.5,-2; J5 0,-2; J6 0.5,-2; J7 1,-2; J8 1.5,-2; J9 2,-2
LGA-12-LISDH12 = smd 0.275 x 0.25: 1 -0.75,0.75; 2 -0.75,0.25; 3 -0.75,-0.25; 4 -0.75,-0.75; 7 0.75,-0.75; 8 0.75,-0.25; 9 0.75,0.25; 10 0.75,0.75 | smd 0.25 x 0.275: 5 -0.25,-0.75; 6 0.25,-0.75; 11 0.25,0.75; 12 -0.25,0.75
SOT23-5 = smd 0.55 x 1.2: 1 -0.95,-1.3; 2 0,-1.3; 3 0.95,-1.3; 4 0.95,1.3; 5 -0.95,1.3
SO08 = smd 0.6 x 1.2: 1 -1.905,-2.8; 2 -0.635,-2.8; 3 0.635,-2.8; 4 1.905,-2.8; 5 1.905,2.8; 6 0.635,2.8; 7 -0.635,2.8; 8 -1.905,2.8
CRYSTAL-SMD-2.0X1.6MM = smd 0.75 x 0.7: 1 -0.675,-0.5; 2 0.675,-0.5; 3 0.675,0.5; 4 -0.675,0.5
CRYSTAL-SMD-3.2X1.5MM = smd 1 x 1.8: P$1 -1.25,0; P$2 1.25,0

### Placement (x,y rotation side)
A1  38.13,16.3 270 top
BT1  10.5,20 90 bottom
C1  23.27,20.5 180 bottom
C2  23.25,15.7 270 top
C3  23.27,19.35 0 bottom
C4  27.4,17.5 270 bottom
C5  25.25,17.77 270 bottom
C6  28.4,14.27 180 top
C7  30.1,15.5 90 top
C8  26.3,17.5 270 bottom
C9  19.8,20.3 270 top
C10  19.8,22.3 90 top
C11  28.9,18.6 180 bottom
C12  23.7,18.25 0 bottom
C13  26.37,19.6 90 bottom
C14  24.88,19.87 90 bottom
C15  28.34,20.1 90 bottom
C16  23.7,17.2 0 bottom
C17  30.1,17.5 270 top
C18  32.63,17.5 270 top
C19  10.7,26.7 0 top
C20  22.5,11 270 top
C21  24,11 270 top
C22  29,32 270 top
C23  24,31 270 top
C24  10,32 270 top
C25  8,34.5 180 top
C26  12,5 0 top
C27  10.5,3 270 top
C28  1.8,31 90 top
D1  11,16.5 180 top
D2  11,18.5 180 top
D3  15,4 270 top
D4  17,4 270 top
D5  21,4 270 top
D6  19,4 270 top
D7  10.7,28 0 top
J1  22.86,3.81 0 top
J2  1.5,20 270 top
J3  22.86,1.27 0 top
J4  35,29 90 top
J5  32,29 270 bottom
J6  20,37 180 top
L1  21.7,18 90 top
L2  25.2,15.8 180 top
L3  31.36,18 0 top
L4  33.9,18 0 top
M1  8,37 180 top
M2  8,3 0 top
R1  0.8,31 90 top
R2  22.3,15.7 270 top
R3  32,33 0 top
R4  32,34 180 top
R5  15,7 90 top
R6  17,7 90 top
R7  21,7 90 top
R8  19,7 90 top
R9  9.5,9 270 top
R10  17.5,31 270 top
R11  29,30 270 top
R12  16,12 180 top
R13  16,31 270 top
R14  16,10 180 top
R15  14.5,31 270 top
R16  11.5,32 90 top
R17  12,6.5 0 top
R18  16,19.5 0 top
R19  16,18.5 180 top
R20  12,8 180 top
R21  10.75,29.6 0 top
R22  18.5,31 90 top
R23  36,25 0 top
R24  36,33 0 top
R25  21.08,13.97 270 top
R26  19.05,13.96 270 top
S1  5,9 180 top
S2  5,31 0 top
TP1  31.75,35.56 0 bottom
TP2  34.29,35.56 0 bottom
TP3  38.1,30.23 0 bottom
TP4  38.1,27.69 0 bottom
TP5  3.81,33.02 0 bottom
TP6  3.81,30.48 0 bottom
TP7  19,33.1 0 bottom
U1  26,20 90 top
U2  20,11 0 top
U3  26.5,31 0 top
U4  14,23 270 top
U$1  [MIC00]  5.92,39.24 0 top
U$2  [BLK2]  4.57,12.32 0 top
U$3  [GND0]  33.66,3.81 45 top
U$4  [VDD1]  22.86,4.83 90 top
U$5  [10]  25.4,4.83 90 top
U$6  [383]  27.94,4.83 90 top
U$7  [364]  30.48,4.83 90 top
U$8  [10]  25.4,4.83 90 bottom
U$9  [VDD1]  22.86,4.83 90 bottom
U$10  [31]  33.02,4.83 90 bottom
U$11  [383]  27.94,4.83 90 bottom
U$12  [364]  30.48,4.83 90 bottom
U$13  [31]  33.02,4.83 90 top
U$14  [GND0]  33.66,3.81 135 bottom
U$15  [461]  14.99,-0.25 90 top
U$16  [372]  17.02,-0.25 90 top
U$17  [443]  19.05,-0.25 90 top
U$18  [470]  21.08,-0.25 90 top
U$19  [QWIIC_COPYRIGHT_SMALL]  36.96,23.37 0 top
U$20  [CAMERA3]  28.45,38.35 0 top
U$21  [POWEREDBY_TF#JPG]  32.26,11.68 0 top
U$22  [MIC11]  5.99,0.74 0 top
U$23  [EDGE0]  28.56,33.96 0 bottom
U$24  [EDGE0]  16.89,25.65 0 top
U$25  [POWEREDBY_TF#JPG]  12.4,3.45 0 bottom
U$26  [1416]  3.4,5.5 0 top
U$28  [GRN1]  4.57,27.69 0 top
U$29  [SFE_LOGO_NAME_.1]  24.64,36 0 bottom
U$30  [OSHW-LOGO-S]  6.64,36 0 bottom
Y1  28.37,15.8 180 top
Y2  21.3,21.3 270 top

### Tracks (layer width: path | path; a pad name or v marks a point on that pad's centre or on a via)
1.8V  (via drill 0.2 pad 0.25, 0.51 pad 0.25)
  Top 0.127: J6.10 18.75,33.35 TP7.P$1 | C23.1 v24,32 24.3,32.3 U3.5
  Bottom 0.127: TP7.P$1 22.9,33.1 v24,32
  other vias: 19,33.1
ADC_VREF  (via drill 0.2)
  Top 0.127: U1.A6 23.72,20.5 v23.11,21.1
  Bottom 0.127: v23.11,21.1 23.11,20.84 C1.1
AMBIQ_!RST  (via drill 0.2)
  Top 0.127: v27.67,25.91 28.21,26.46 J5.10 v31.36,23.24 | C28.1 R1.1 0.8,30.11 1.82,29.09 S2.3 S2.4 8.21,29.09 8.8,28.5 v8.8,28.4 | C19.2 v11.2,27.38
  Bottom 0.127: v31.36,23.24 30.48,22.35 30.48,21.45 29.9,20.86 29.9,20.07 28.92,19.09 28.02,19.09 27.93,19 U1.G3 | v27.67,25.91 14.96,25.91 13.49,27.38 v11.2,27.38 9.82,27.38 v8.8,28.4
  other vias: 27,19
CUTOUT
  cutout Route15 (isolate 0.152): 34,23 40,23 40,3 34,3
  cutout Route2 (isolate 0.152): 34,23 40,23 40,3 34,3
DTR
  Top 0.127: J2.1 9.05,26.35 9.55,26.85 | 9.55,26.85 D7.C | C19.1 9.7,26.7 9.55,26.85
DVDD  (via drill 0.2, 0.2 layers 1-15)
  Route15 0.127: U1.H3 28.2,19 v28.6,18.6
  Bottom 0.127: v28.6,18.6 C11.1
  other vias: 27.5,19
FTDI_VCC
  Top 0.127: 9.9,18.5 D2.A
  Top 0.305: J2.4 8.77,18.73 9,18.5 D2.A
GND  (via drill 0.2, 0.2 layers 1-2, 0.2 pad 0.25, 0.2 pad 0.25 layers 1-2)
  Top 0.127: U2.5 19.75,9.75 19.9,9.6 20.3,9.6 | 20.8,9.6 21.6,9.6 22,10 | 20.8,9.6 20.3,9.6 | 22,10 C20.2 | U2.6 20.25,9.65 20.3,9.6 | U2.7 20.75,9.65 20.8,9.6 | U2.8 21.25,10.75 22,10 | J6.15 21.25,35.75 v21,36 | J6.2 14.75,35.75 v15,36
  Bottom 0.127: BT1.2 10.5,20.28
  Bottom 0.152: C13.2 25.69,20.1 25.65,20.07 25.35,20.37 C14.2
  Bottom 0.254: C14.2 23.9,20.37 C1.2
  other vias: 27.5,18 27.5,18.5 28,18.5 26.5,18.5 26,18.5 26,19 25,18.5 24.5,19 28.9,14.27 30.1,15 32.63,17 30.1,17 19.8,21.8 19.8,20.8 7.33,38.09 8.68,38.09 7.5,34.5 7.79,32.91 2.21,32.91 16.5,18.5 11.2,21.09 10.5,20 6.5,13.65 7.79,7.09 2.21,7.09 7.33,1.91 8.68,1.91 10.5,2.5 15,3.12 17,3.12 29,31.5 26.5,29.7 24,30.5 22.5,10.5 24,10.15 28,27.9 29,30.5 18.5,30.5 35,27.5 32.5,34 21,3.12 19,3.12 28.7,22.76 29.21,17.53 22.35,17.99 25.22,16.29 22.12,21.44 23.25,15.2 1.8,31.5
  pour Route2 (isolate 0.254, rank 6): 0,40 0,0 40,0 40,40
  pour Bottom (isolate 0.127): 0,40 0,0 40,0 40,40
GPIO0/ACCEL_INT2  (via drill 0.2, 0.2 layers 1-15)
  Top 0.127: U2.11 v20.25,12.45 20.25,13.14 20.58,13.47 R25.2
  Route15 0.127: U1.H4 28.14,19.5 28.55,19.92 28.89,19.92 30.16,18.64 v30.21,18.64
  Bottom 0.127: 30.21,18.43 v30.21,18.64 30.21,15.62 27.05,12.45 v20.25,12.45
  other vias: 27.5,19.5
GPIO1_J3_2  (via drill 0.2)
  Top 0.127: v29.5,20.23 30.34,20.23 v30.94,19.63 | v25,9.45 24.13,8.58 24.13,2.54 J3.2
  Bottom 0.127: U1.G4 27.13,19.63 27.15,19.63 27.37,19.85 27.37,19.87 27.59,20.09 29.36,20.09 v29.5,20.23 | v30.94,19.63 31.5,19.07 31.5,15.62 25.33,9.45 v25,9.45
  other vias: 27,19.5
GPIO3_J3_5  (via drill 0.2)
  Top 0.127: v32.56,21.09 32.29,21.37 v29.17,21.37
  Bottom 0.127: U1.G5 27.13,20.13 27.15,20.13 27.64,20.63 27.64,20.98 28.03,21.37 v29.17,21.37 | J3.5 31.75,2.54 31.75,8.38 33.25,9.88 33.25,20.41 32.69,20.98 32.67,20.98 v32.56,21.09
  other vias: 27,20
GPIO4/CAMERA_Y4
  Top 0.127: 22.67,34.52 J6.18 22.75,32.79 22.49,32.53 22.49,27.79 25.27,25.01 25.27,24.69 25.5,24.46 U1.D9
GPIO5/CAMERA_Y3
  Top 0.127: U1.E9 26,25 23,28 23,32.32 23.75,33.07 J6.20
GPIO6/CAMERA_Y0  (via drill 0.2 layers 1-15)
  Top 0.127: v25.63,24.84 25.63,25 22.75,27.89 22.75,32.42 23.25,32.93 J6.19
  Route15 0.127: v25.63,24.84 26,24.48 U1.E8
  other vias: 26,21.5
GPIO7/CAM_XCLK  (via drill 0.2)
  Top 0.127: U1.F9 26.5,23.7 v26.37,23.83 | v23.69,25 23.69,25.15 20.25,28.59 J6.13
  Bottom 0.127: v26.37,23.83 24.85,23.83 24.73,23.95 24.73,23.98 24.52,24.2 24.49,24.2 v23.69,25
GPIO8/CAMERA_Y1  (via drill 0.2 layers 1-15)
  Top 0.127: J6.21 24.26,33.22 23.26,32.22 23.26,28.1 26.56,24.8 v26.56,24.64
  Route15 0.127: v26.56,24.64 26.5,24.58 26.5,24.21 26.73,23.98 26.73,23.68 26.5,23.44 U1.F8
  other vias: 26.5,21.5
GPIO9/CAMERA_Y2  (via drill 0.2)
  Top 0.127: v28.12,23.67 23.51,28.28 23.51,32.11 24.75,33.35 J6.22
  Bottom 0.127: U1.G7 27,22.09 28.12,23.22 v28.12,23.67
  other vias: 27,21
GPIO10/CAMERA_DVDD_EN  (via drill 0.2 layers 1-15)
  Top 0.127: U3.3 27.46,28.39 27.65,28.2 27.7,28.2 | R11.2 27.7,28.2 | 27.7,28.2 27.3,27.8 v27.3,25.02
  Route15 0.127: U1.G8 27,21.74 27.25,22 27.25,23 27,23.25 27,24.72 v27.3,25.02
  other vias: 27,21.5
GPIO11/MIC0  (via drill 0.2 layers 1-15)
  Top 0.127: v11.2,24.24 U4.1 11.52,24.91 12.72,26.11 12.72,28.52 12.45,28.8 10.74,28.8 9.95,29.6 R21.1
  Route15 0.127: v11.2,24.24 14.7,20.74 23.75,20.74 24.35,20.13 24.37,20.13 U1.B5
  other vias: 24.5,20
GPIO12/CAMERA_VSYNC
  Top 0.127: J6.7 17.25,33.05 17.99,32.31 17.99,29.01 22.89,24.11 22.89,23.68 23.31,23.26 23.31,21.71 24,21.02 U1.A7
GPIO13/CAMERA_PWDN  (via drill 0.2 layers 1-15, 0.2 pad 0.25 layers 1-2)
  Top 0.127: v18,35.72 17.75,35.47 J6.8 17.75,33.15 19.24,31.66 19.24,31.5 | R22.2 19.24,31.5 | v22.47,25.13 19.24,28.36 19.24,31.5
  Route15 0.127: v22.47,25.13 22.59,25.02 22.59,24.86 22.8,24.64 22.96,24.64 23.75,23.86 23.75,21.73 24.35,21.13 24.37,21.13 U1.B7
  other vias: 24.5,21
GPIO14/USER_BUTTON  (via drill 0.2)
  Top 0.127: R9.1 9.5,10.31 | S1.4 S1.3 9.5,10.9 | 9.5,10.9 11.55,10.9 17.63,16.99 v17.63,20.37 | 9.5,10.31 | 9.5,10.31 9.5,10.9 | D7.A 11.85,27.24 v12.33,26.75
  Bottom 0.127: U1.D7 25.5,22.27 25.3,22.47 19.73,22.47 v17.63,20.37 17.55,20.37 15.11,22.81 15.11,25.4 13.76,26.75 v12.33,26.75
  other vias: 25.5,21
GPIO15/CAMERA_RESET  (via drill 0.2)
  Top 0.127: v22.94,22.1 23.05,22.22 23.05,23.15 22.64,23.57 22.64,24 17.01,29.63 17.01,31.5 | J6.6 16.75,33.14 17.01,32.88 17.01,31.5 | R10.1 17.01,31.5
  Bottom 0.127: U1.C7 23.9,22.1 v22.94,22.1
  other vias: 25,21
GPIO17/ACCEL_INT1  (via drill 0.2)
  Top 0.127: v19.81,17.78 19.75,17.72 19.75,13.46 | 19.75,13.46 U2.12 | R26.2 19.75,13.46
  Bottom 0.127: U1.D3 25.37,18.87 24.51,18.87 24.37,19.02 24.37,19.73 24.17,19.92 21.95,19.92 v19.81,17.78
  other vias: 25.5,19
GPIO20/SWDCK  (via drill 0.2 pad 0.25, 0.51)
  Top 0.127: R4.2 30.6,33.1 30.6,31.04 J5.4
  Top 0.152: R4.2 31.5,35.31 TP1.P$1
  Bottom 0.127: U1.G6 27.13,20.63 27.15,20.63 27.37,20.85 27.37,21.15 27.25,21.27 27.25,21.99 28.52,23.26 28.52,25.52 30.25,27.25 30.25,29.16 J5.4
  other vias: 27,20.5 31.75,35.56
GPIO21/SWDIO  (via drill 0.2 pad 0.25, 0.51)
  Top 0.127: R3.1 31.5,31.68 J5.2
  Bottom 0.127: U1.F7 26.5,21.95 27.76,23.21 27.76,25.11 30,27.36 30,30.18 J5.2
  Bottom 0.152: J5.2 34.29,34.47 TP2.P$1
  other vias: 26.5,21 34.29,35.56
GPIO22/CAMERA_Y5
  Top 0.127: U1.C9 25,24.24 24.53,24.71 24.53,25.03 21.75,27.81 J6.16
GPIO23/CAMERA_PCLK  (via drill 0.2 layers 1-15)
  Top 0.127: J6.17 | v24.9,24.86 24.9,25.02 22.24,27.68 22.24,34.59 J6.17
  Route15 0.127: U1.D8 25.5,24.26 v24.9,24.86
  other vias: 25.5,21.5
GPIO24/CAMERA_Y6  (via drill 0.2 layers 1-15)
  Top 0.127: J6.14 20.75,28.45 24.17,25.03 v24.17,24.88
  Route15 0.127: U1.C8 25,24.04 v24.17,24.88
  other vias: 25,21.5
GPIO25/I2C_SDA_CAMERA  (via drill 0.2)
  Top 0.127: U1.A8 24,21.54 23.98,21.56 23.82,21.56 23.56,21.82 23.56,23.52 v23.26,23.83 | J6.3 15.25,31.85 | 15.25,31.85 15.25,29.45 15.49,29.21 16.71,29.21 21.54,24.38 v21.54,23.83 | R15.1 15.25,31.85
  Bottom 0.127: v23.26,23.83 22.09,23.83 22.08,23.82 21.78,23.82 21.77,23.83 v21.54,23.83
GPIO26/CAMERA_HREF  (via drill 0.2 layers 1-15)
  Top 0.127: J6.9 18.24,34.59 18.24,33.02 19.5,31.77 19.5,28.63 22.95,25.17 v22.95,25.01
  Route15 0.127: U1.B8 24,22 24,23.96 v22.95,25.01
  other vias: 24.5,21.5
GPIO27/I2C_SCL_CAMERA  (via drill 0.2)
  Top 0.127: U1.B9 24.5,23.7 v24.37,23.83 | J6.5 16.25,33.28 16.76,32.77 16.76,31.75 | R13.1 16.1,31.75 16.76,31.75 | v21.93,24.19 21.93,24.35 16.76,29.53 16.76,31.75
  Bottom 0.127: v24.37,23.83 24,24.2 v21.93,24.2 v21.93,24.19
GPIO28/CAMERA_Y7
  Top 0.127: U1.A9 24,24.16 23.32,24.84 23.32,25.16 19.75,28.73 J6.12
GPIO29/MIC1
  Top 0.127: 13,7.85 R20.1 12.85,11.49 18.25,16.89 18.25,21.52 18.09,21.68 18.09,22.61 17.74,22.95 | U4.7 17.05,23.64 17.74,22.95 | U1.A5 23.56,20 22.52,21.04 22.52,23.07 22.21,23.38 18.17,23.38 17.74,22.95
GPIO33/SWO  (via drill 0.2, 0.2 layers 1-15)
  Top 0.127: J5.6 31.34,29 31.33,29.01 v29.63,29.01
  Route15 0.127: U1.B6 24.37,20.63 24.35,20.63 23.24,21.74 22.79,21.74 21.17,23.35 v21.17,24.14
  Bottom 0.127: v21.17,24.14 22.39,25.36 27.63,25.36 29.63,27.36 v29.63,29.01
  other vias: 24.5,20.5
GPIO36_J3_4  (via drill 0.2, 0.2 layers 1-15)
  Route15 0.127: 27.52,20.48 U1.H6 27.63,20.63 27.65,20.63 27.77,20.75 30.91,20.75 31.88,19.78 v32.89,19.78
  Bottom 0.127: J3.4 29.21,2.54 29.21,6.19 32.89,9.87 v32.89,19.78
  other vias: 27.5,20.5
GPIO37_LED_BLUE  (via drill 0.2, 0.2 layers 1-15)
  Top 0.127: R6.2 17,7.87 v18.09,8.97
  Route15 0.127: U1.H7 31.22,21 v31.95,20.27
  Bottom 0.127: v31.95,20.27 32.01,20.21 32.01,15.08 26.01,9.08 18.2,9.08 v18.09,8.97
  other vias: 27.5,21
GPIO38_J3_3  (via drill 0.2)
  Top 0.127: 28.02,20.48 U1.J6 28.25,20.75 30.39,20.75 v31.43,19.71 | v25.85,9.45 25.85,5.39 26.67,4.57 26.67,2.54 J3.3
  Bottom 0.127: v31.43,19.71 31.76,19.38 31.76,15.51 25.85,9.61 v25.85,9.45
GPIO39_QWIIC_SCK  (via drill 0.2, 0.51)
  Top 0.127: R24.1 35.15,31.34 v35.05,31.24 35.05,30.55 J4.4 37.83,30.5 TP3.P$1 | v34.29,24.38 34.29,24.23 31.79,21.73 28.23,21.73 U1.J8
  Bottom 0.127: v34.29,24.38 34.29,30.48 v35.05,31.24
  other vias: 38.1,30.23
GPIO40_QWIIC_SDA  (via drill 0.51)
  Top 0.127: U1.J9 31.7,22 33.78,24.09 33.78,25.04 | 34.7,25 R23.1 35.11,25.04 33.78,25.04 | 33.78,25.04 33.78,29.21 34.07,29.5 J4.3 36.29,29.5 TP4.P$1
  other vias: 38.1,27.69
GPIO42/I2C_SCLK  (via drill 0.2, 0.2 layers 1-15)
  Top 0.127: R12.1 17.97,12 v18.03,11.94 18.22,11.75 U2.1
  Route15 0.127: v30.76,19.18 30.07,19.87 29.35,19.87 29,20.22 27.97,20.22 27.75,20 U1.H5
  Bottom 0.127: v18.03,11.94 26.9,11.94 30.76,15.8 v30.76,19.17 v30.76,19.18
  other vias: 27.5,20
GPIO43/I2C_SDA  (via drill 0.2)
  Top 0.127: R14.1 17.01,10.16 v18.03,10.16 18.12,10.25 U2.4 | U1.J5 28.44,20 28.57,19.87 30,19.87 30.39,19.48 30.39,19 30.58,18.81 31,18.81 v31.13,18.69
  Bottom 0.127: v18.03,10.16 25.48,10.16 31.13,15.81 v31.13,18.69
GPIO44/LED_GREEN  (via drill 0.2)
  Top 0.127: v32.43,20.36 32.38,20.36 31.74,21 U1.J7 | R8.2 v19.86,8.71
  Bottom 0.127: v32.43,20.36 32.43,20.23 32.27,20.07 32.27,14.97 26.12,8.82 19.98,8.82 v19.86,8.71
GPIO46/LED_RED  (via drill 0.2)
  Top 0.127: R5.2 14.22,8.63 14.22,12.51 18.51,16.79 18.51,21.62 18.45,21.68 v18.45,22.3
  Bottom 0.127: U1.E7 26,22.51 25.79,22.73 18.88,22.73 v18.45,22.3
  other vias: 26,21
GPIO47/LED_YELLOW  (via drill 0.2)
  Top 0.127: U1.H9 27.55,22 27.87,22.32 31.5,22.32 v31.54,22.37 | R7.2 21.02,7.88 21.77,7.88 v21.9,8
  Bottom 0.127: v31.54,22.37 31.54,21.59 32.41,20.73 32.58,20.73 32.8,20.51 32.8,20.21 32.52,19.93 32.52,14.87 26.22,8.57 22.47,8.57 v21.9,8
MIC0_OUT
  Top 0.127: M1.1 8.8,35.9 10,34.7 C24.1
MIC1_OUT
  Top 0.127: M2.1 7.33,4.72 7.6,5 C26.1
N$1
  Top 0.305: L4.2 A1.FEED
N$2
  Top 0.127: U1.G1 27,17.7 27.7,17 28.35,17 Y1.1 29.25,16.1 29.9,16.1 30,16 C7.2
N$3
  Top 0.127: U1.F1 26.5,17.2 27,16.7 27,16 Y1.3 27.9,15.1 C6.2
N$5
  Top 0.127: R6.1 D4.A
N$6
  Top 0.127: R5.1 D3.A
N$7
  Top 0.127: R7.1 D5.A
N$8
  Top 0.127: R8.1 D6.A
N$9
  Top 0.127: U4.5 15.5,21.09 | 15.5,21.09 14.9,21.09 13.63,22.36 U4.3 | R19.2 R18.1 15.5,21.09
N$10
  Top 0.127: C24.2 10.8,31.95 10.8,32.1 11.5,32.8 R16.2
N$11
  Top 0.127: U4.6 17.05,22.36 18,21.41 18,17 11.15,10.15 R20.2 R17.1
N$12  (via drill 0.2 pad 0.25 layers 1-15)
  Top 0.127: U4.2 v12.7,23.64 | v12.57,29.59 R21.2 11.6,31.05 R16.1
  Route15 0.127: v12.7,23.64 12.7,29.46 v12.57,29.59
N$14
  Top 0.127: C26.2 R17.2
N$16
  Top 0.305: L3.2 C18.1 L4.1
RFIOP
  Top 0.305: U1.J1 C17.1 L3.1
SIMBUCK_SWSEL
  Top 0.356: U1.A2 22.57,18.5 22.27,18.8 L1.2
SIMOBUCK_SW
  Top 0.356: U1.A1 23.52,18 22.72,17.2 L1.1
UART-RX/GPIO49  (via drill 0.2, 0.2 pad 0.25 layers 1-15, 0.51)
  Top 0.127: v15.83,23.35 15.83,23.19 15.89,23.13 15.89,22.83 15.67,22.61 13.75,22.61 13.5,22.86 9.12,22.86 7.57,21.3 6.53,21.3 J2.3 5.53,21.27 v4.3,22.5
  Route15 0.127: U1.H8 27.5,21.88 27.51,21.89 27.51,23.34 v27.39,23.46
  Bottom 0.127: v15.83,23.35 15.95,23.46 v27.39,23.46 | v4.3,22.5 4.3,29.99 TP6.P$1
  other vias: 27.5,21.5 3.81,30.48
UART-TX/GPIO48  (via drill 0.2, 0.51)
  Top 0.127: U1.G9 27,22.73 v26.87,22.87 | v15.52,22.98 13.74,22.98 13.61,23.11 9.15,23.11 8.45,23.81 J2.2 5.49,23.81 v4.8,24.5
  Bottom 0.127: v26.87,22.87 26.75,22.98 v15.52,22.98 | v4.8,24.5 4.8,32.03 TP5.P$1
  other vias: 3.81,33.02
V_BATT  (via drill 0.2 pad 0.25)
  Top 0.305: D1.A 9.85,15.15 v12,13
  Bottom 0.127: 12,9.05 BT1.1
  Bottom 0.305: v12,13 12,9.05
VDCDCRF  (via drill 0.2, 0.2 pad 0.25)
  Bottom 0.127: U1.G2 27,18.4 C4.1
  Bottom 0.152: C4.1 27.93,17.48 27.93,16.02 27.1,15.2 R2.2
  other vias: 27,18.5 22.3,15.2
VDD  (via drill 0.2, 0.2 layers 1-15, 0.2 pad 0.25, 0.2 pad 0.25 layers 1-15)
  Top 0.127: U2.2 17.99,11.25 | 17.99,11.25 15.95,11.25 | R12.2 15.2,12 15.95,11.25 | U2.3 18.25,10.75 17.99,11.01 17.99,11.25 | 15.95,11.25 15.15,10.45 R14.2 | U2.10 21.7,11.75 | 21.7,11.75 22.25,11.75 C20.1 | U2.9 21.45,11.25 21.7,11.5 21.7,11.75 | J6.11 19.25,35.75 18.9,36.1 v17,36.1 16.1,36.1 15.75,35.75 J6.4 | v12.15,15.5 D1.C | C21.1 24.13,11.72 24.13,11.43 | U1.J4 v28.77,19.5
  Bottom 0.127: U1.C4 24.88,19.38 C14.1 | 28.2,19.5 28.23,19.5 C15.1 28.43,19.5 v28.77,19.5 | U1.F3 26.48,19 C13.1 | U1.B2 24.25,18.25 C12.1 24.2,18 | 24.2,18 C16.1 | U1.B1 24.2,18
  other vias: 24.5,18.5 25,19.5 26.5,19 8.5,34.5 7.33,35.91 16.8,24.91 16.5,19.5 12.15,18.5 15.15,12 15.15,10 29,32.5 25.55,29.7 22.5,11.5 24,11.85 14.5,30.15 16,30.15 17.5,30.5 9.5,8.5 8.68,4.09 10.5,3.5 24.5,18 36.85,25 35,28.5 36.85,33 32.5,33 0.8,31.5 21.08,14.47 19.05,14.46
  pour Route15 (isolate 0.254): 0,40 0,0 40,0 40,40
VDDBH
  Top 0.127: 24.4,16.28 24.32,16.2
  Top 0.152: 22.45,16.2 R2.1
  Top 0.356: U1.C1 25,16.88 24.4,16.28 L2.2 | 24.32,16.2 C2.1 22.45,16.2
VDDBH_SW
  Top 0.356: U1.D1 25.5,16.87 26,16.37 L2.1
VDDC  (via drill 0.2 pad 0.25)
  Bottom 0.127: C3.1 23.77,19.23 U1.A3
  other vias: 24,19
VDDF  (via drill 0.2 pad 0.25)
  Bottom 0.127: C5.1 25.27,18.27 U1.D2
  other vias: 25.5,18.5
VDDS  (via drill 0.2 pad 0.25)
  Bottom 0.127: C8.1 U1.E1
  other vias: 26,18
X0
  Top 0.127: C10.2 21.05,22.8 Y2.P$1 21.3,21.03 21.51,20.82 22.25,20.82 22.42,20.65 22.42,19.8 22.71,19.5 U1.A4
XI  (via drill 0.2 layers 1-15)
  Top 0.127: C9.2 21.05,19.8 Y2.P$2
  Route15 0.127: U1.B4 21.85,19.5 Y2.P$2
  other vias: 24.5,19.5 21.3,20.05

### Text on the board
Bottom: v01